# EAGLE design 2023-03-01_Twin_Io_Schematic (EAGLE 9.6.2)
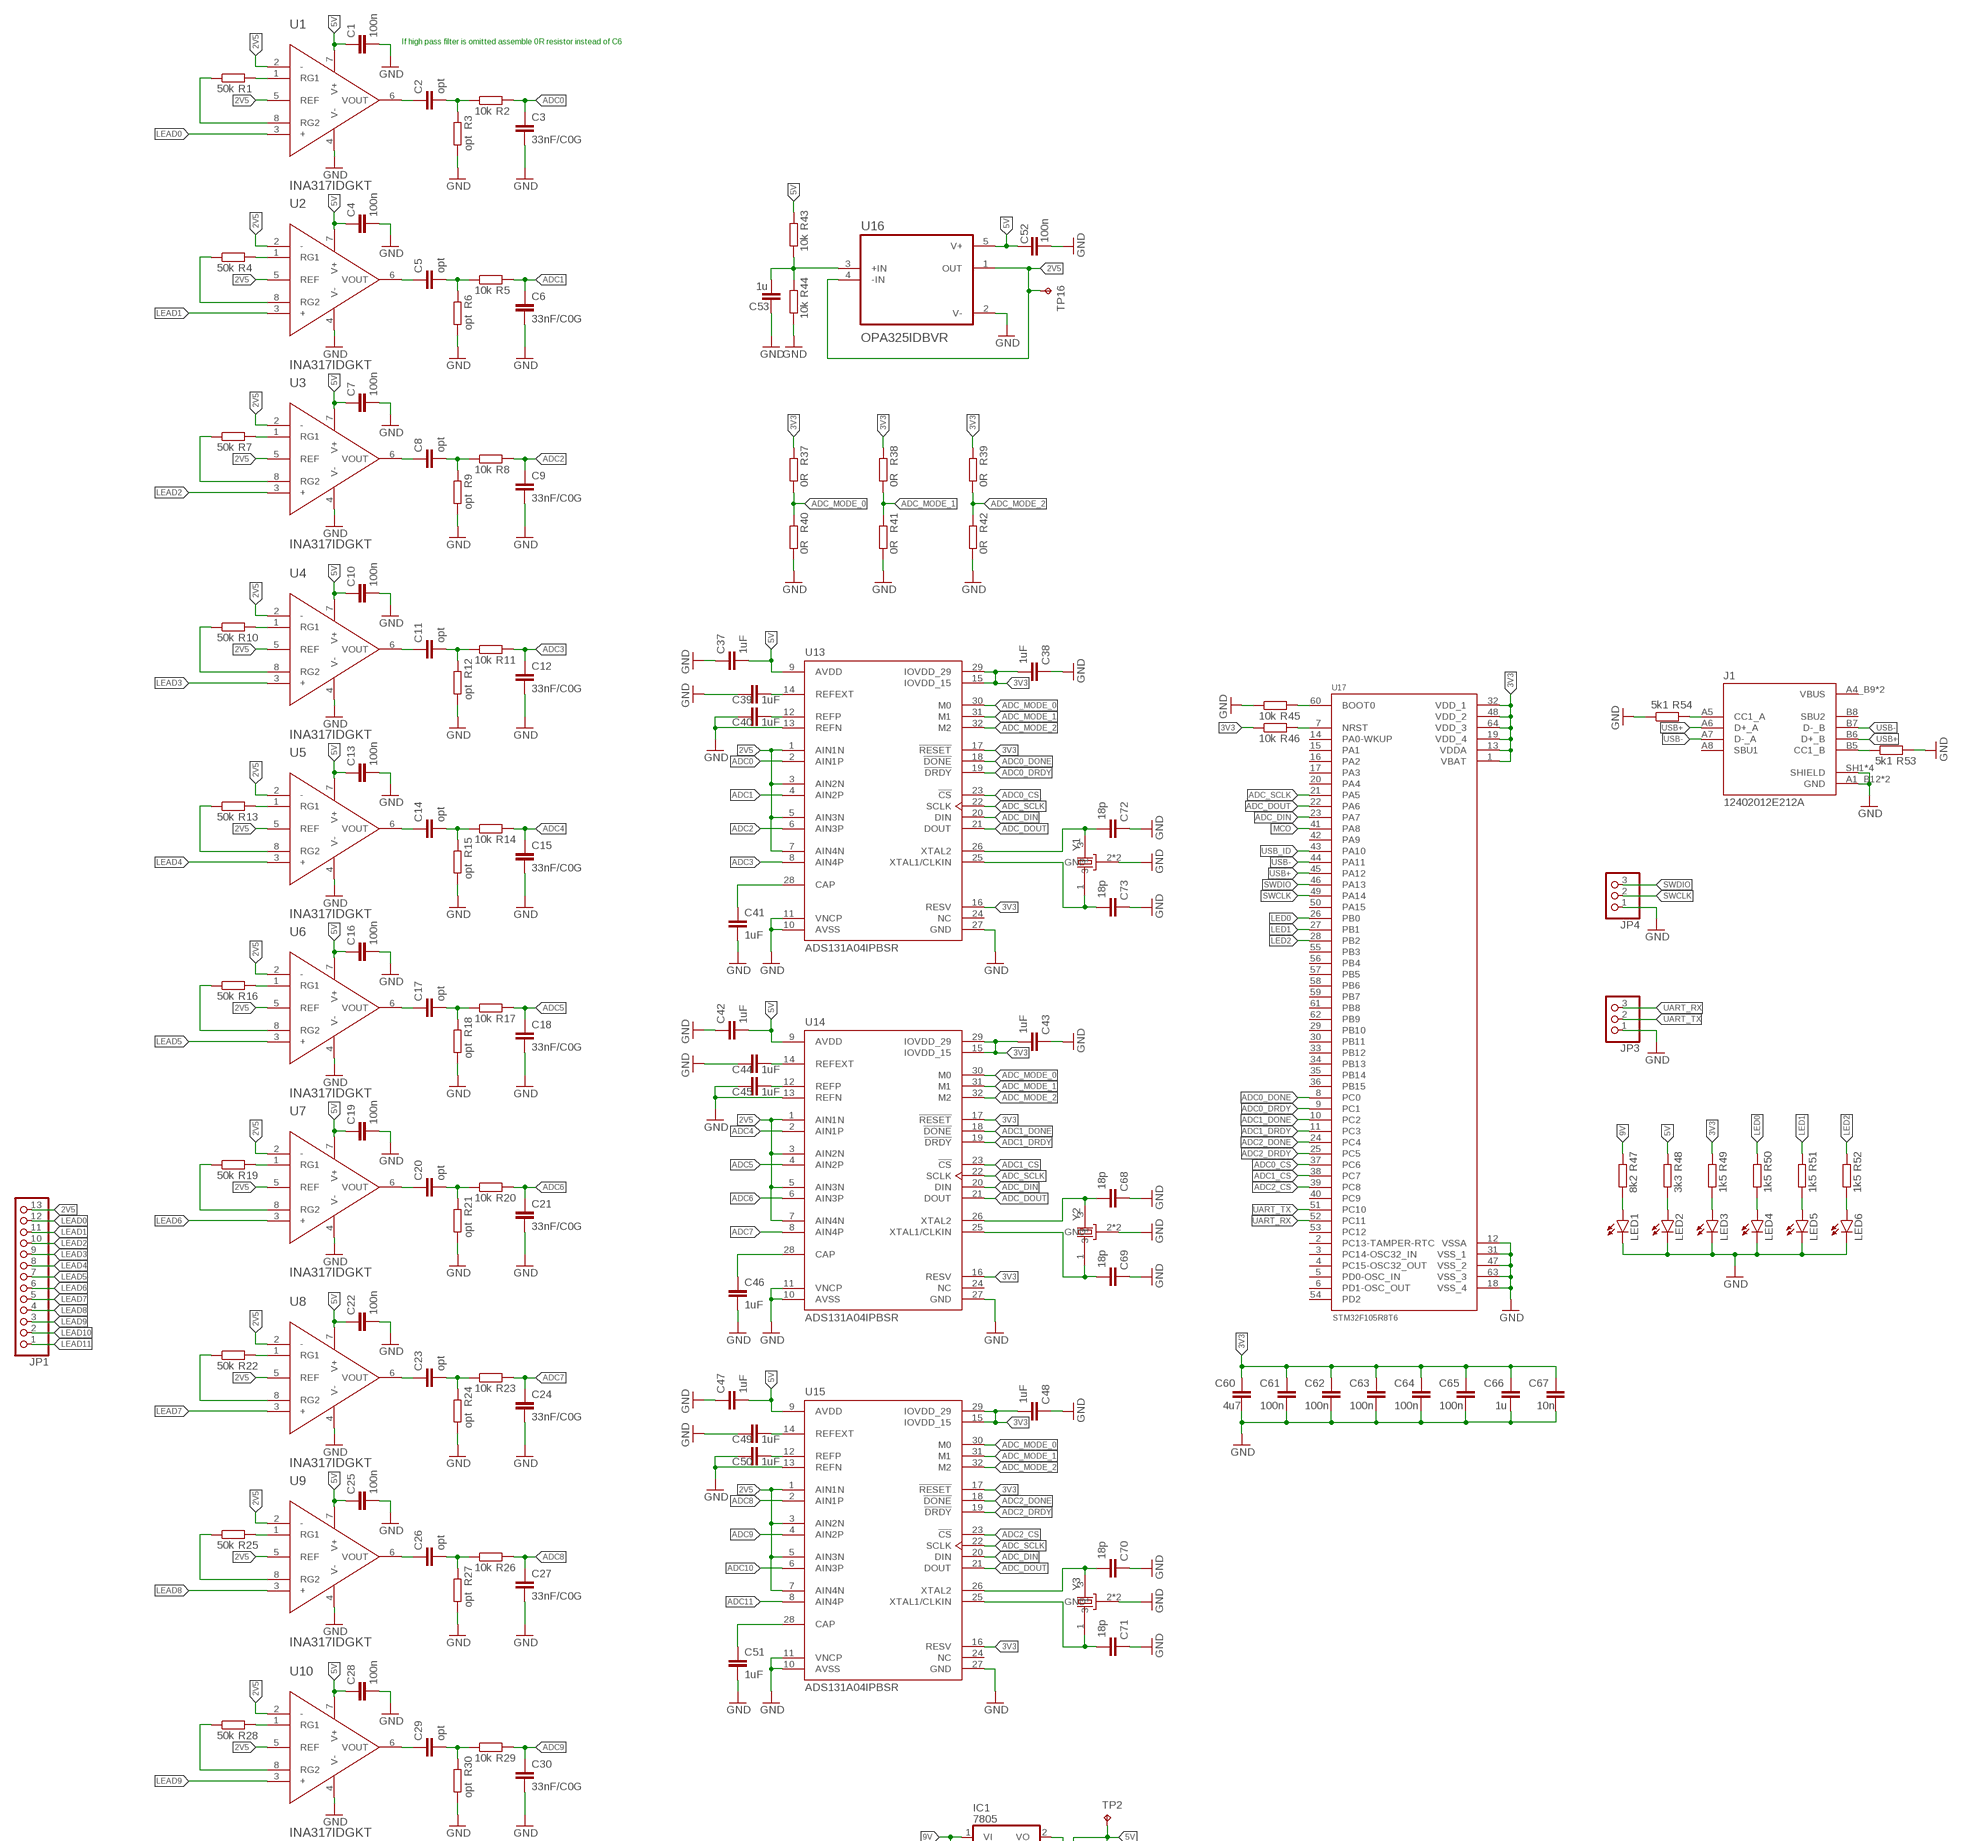
[diagram p0: schematic, sheet 1, part 1 of 2]
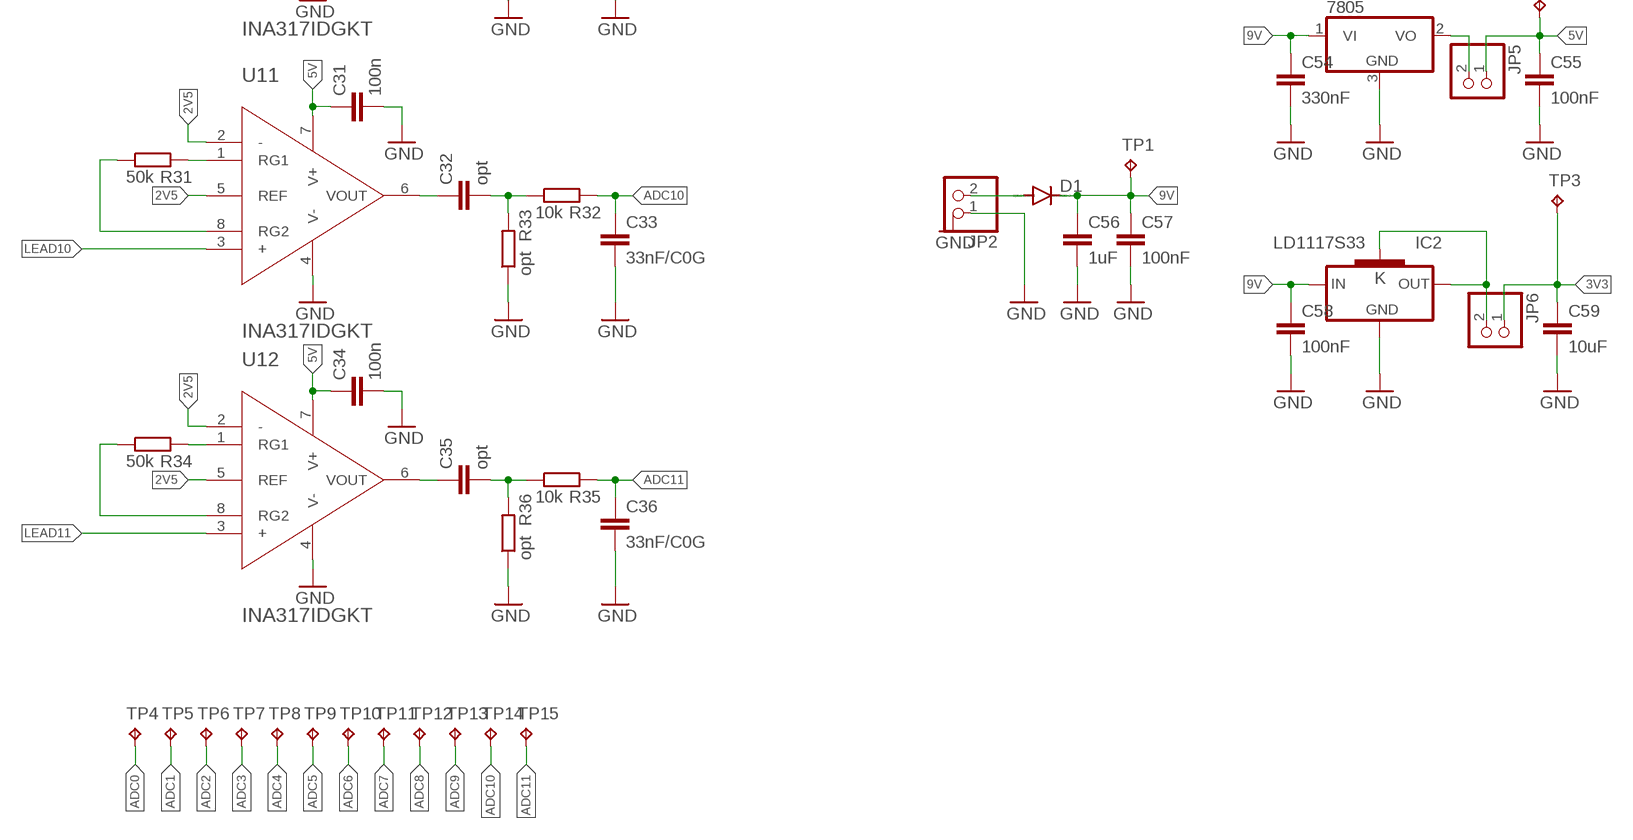
[diagram p1: schematic, sheet 1, part 2 of 2]

## Parts
C1  100n  C-EUC0603  [C0603]
C2  opt  C-EUC0603  [C0603]
C3  33nF/C0G  C-EUC0603  [C0603]
C4  100n  C-EUC0603  [C0603]
C5  opt  C-EUC0603  [C0603]
C6  33nF/C0G  C-EUC0603  [C0603]
C7  100n  C-EUC0603  [C0603]
C8  opt  C-EUC0603  [C0603]
C9  33nF/C0G  C-EUC0603  [C0603]
C10  100n  C-EUC0603  [C0603]
C11  opt  C-EUC0603  [C0603]
C12  33nF/C0G  C-EUC0603  [C0603]
C13  100n  C-EUC0603  [C0603]
C14  opt  C-EUC0603  [C0603]
C15  33nF/C0G  C-EUC0603  [C0603]
C16  100n  C-EUC0603  [C0603]
C17  opt  C-EUC0603  [C0603]
C18  33nF/C0G  C-EUC0603  [C0603]
C19  100n  C-EUC0603  [C0603]
C20  opt  C-EUC0603  [C0603]
C21  33nF/C0G  C-EUC0603  [C0603]
C22  100n  C-EUC0603  [C0603]
C23  opt  C-EUC0603  [C0603]
C24  33nF/C0G  C-EUC0603  [C0603]
C25  100n  C-EUC0603  [C0603]
C26  opt  C-EUC0603  [C0603]
C27  33nF/C0G  C-EUC0603  [C0603]
C28  100n  C-EUC0603  [C0603]
C29  opt  C-EUC0603  [C0603]
C30  33nF/C0G  C-EUC0603  [C0603]
C31  100n  C-EUC0603  [C0603]
C32  opt  C-EUC0603  [C0603]
C33  33nF/C0G  C-EUC0603  [C0603]
C34  100n  C-EUC0603  [C0603]
C35  opt  C-EUC0603  [C0603]
C36  33nF/C0G  C-EUC0603  [C0603]
C37  1uF  C-EUC0603  [C0603]
C38  1uF  C-EUC0603  [C0603]
C39  1uF  C-EUC0603  [C0603]
C40  1uF  C-EUC0603  [C0603]
C41  1uF  C-EUC0603  [C0603]
C42  1uF  C-EUC0603  [C0603]
C43  1uF  C-EUC0603  [C0603]
C44  1uF  C-EUC0603  [C0603]
C45  1uF  C-EUC0603  [C0603]
C46  1uF  C-EUC0603  [C0603]
C47  1uF  C-EUC0603  [C0603]
C48  1uF  C-EUC0603  [C0603]
C49  1uF  C-EUC0603  [C0603]
C50  1uF  C-EUC0603  [C0603]
C51  1uF  C-EUC0603  [C0603]
C52  100n  C-EUC0603  [C0603]
C53  1u  C-EUC0603  [C0603]
C54  330nF  C-EUC0603  [C0603]
C55  100nF  C-EUC0603  [C0603]
C56  1uF  C-EUC0603  [C0603]
C57  100nF  C-EUC0603  [C0603]
C58  100nF  C-EUC0603  [C0603]
C59  10uF  C-EUC0603  [C0603]
C60  4u7  C-EUC0603  [C0603]
C61  100n  C-EUC0603  [C0603]
C62  100n  C-EUC0603  [C0603]
C63  100n  C-EUC0603  [C0603]
C64  100n  C-EUC0603  [C0603]
C65  100n  C-EUC0603  [C0603]
C66  1u  C-EUC0603  [C0603]
C67  10n  C-EUC0603  [C0603]
C68  18p  C-EUC0603  [C0603]
C69  18p  C-EUC0603  [C0603]
C70  18p  C-EUC0603  [C0603]
C71  18p  C-EUC0603  [C0603]
C72  18p  C-EUC0603  [C0603]
C73  18p  C-EUC0603  [C0603]
D1  DIODE-DO214AA  [DO214AA]
IC1  7805  7806DT  [TO252]
IC2  LD1117S33  [SOT223]
J1  12402012E212A  [AMPHENOL_12402012E212A]
JP1  PINHD-1X13  [1X13]
JP2  PINHD-1X2  [1X02]
JP3  PINHD-1X3  [1X03]
JP4  PINHD-1X3  [1X03]
JP5  PINHD-1X2  [1X02]
JP6  PINHD-1X2  [1X02]
LED1  LEDSML1206  [SML1206]
LED2  LEDSML1206  [SML1206]
LED3  LEDSML1206  [SML1206]
LED4  LEDSML1206  [SML1206]
LED5  LEDSML1206  [SML1206]
LED6  LEDSML1206  [SML1206]
R1  50k  R-EU_R0603  [R0603]
R2  10k  R-EU_R0603  [R0603]
R3  opt  R-EU_R0603  [R0603]
R4  50k  R-EU_R0603  [R0603]
R5  10k  R-EU_R0603  [R0603]
R6  opt  R-EU_R0603  [R0603]
R7  50k  R-EU_R0603  [R0603]
R8  10k  R-EU_R0603  [R0603]
R9  opt  R-EU_R0603  [R0603]
R10  50k  R-EU_R0603  [R0603]
R11  10k  R-EU_R0603  [R0603]
R12  opt  R-EU_R0603  [R0603]
R13  50k  R-EU_R0603  [R0603]
R14  10k  R-EU_R0603  [R0603]
R15  opt  R-EU_R0603  [R0603]
R16  50k  R-EU_R0603  [R0603]
R17  10k  R-EU_R0603  [R0603]
R18  opt  R-EU_R0603  [R0603]
R19  50k  R-EU_R0603  [R0603]
R20  10k  R-EU_R0603  [R0603]
R21  opt  R-EU_R0603  [R0603]
R22  50k  R-EU_R0603  [R0603]
R23  10k  R-EU_R0603  [R0603]
R24  opt  R-EU_R0603  [R0603]
R25  50k  R-EU_R0603  [R0603]
R26  10k  R-EU_R0603  [R0603]
R27  opt  R-EU_R0603  [R0603]
R28  50k  R-EU_R0603  [R0603]
R29  10k  R-EU_R0603  [R0603]
R30  opt  R-EU_R0603  [R0603]
R31  50k  R-EU_R0603  [R0603]
R32  10k  R-EU_R0603  [R0603]
R33  opt  R-EU_R0603  [R0603]
R34  50k  R-EU_R0603  [R0603]
R35  10k  R-EU_R0603  [R0603]
R36  opt  R-EU_R0603  [R0603]
R37  0R  R-EU_R0603  [R0603]
R38  0R  R-EU_R0603  [R0603]
R39  0R  R-EU_R0603  [R0603]
R40  0R  R-EU_R0603  [R0603]
R41  0R  R-EU_R0603  [R0603]
R42  0R  R-EU_R0603  [R0603]
R43  10k  R-EU_R0603  [R0603]
R44  10k  R-EU_R0603  [R0603]
R45  10k  R-EU_R0603  [R0603]
R46  10k  R-EU_R0603  [R0603]
R47  8k2  R-EU_R0603  [R0603]
R48  3k3  R-EU_R0603  [R0603]
R49  1k5  R-EU_R0603  [R0603]
R50  1k5  R-EU_R0603  [R0603]
R51  1k5  R-EU_R0603  [R0603]
R52  1k5  R-EU_R0603  [R0603]
R53  5k1  R-EU_R0603  [R0603]
R54  5k1  R-EU_R0603  [R0603]
TP1  TPPAD1-17  [P1-17]
TP2  TPPAD1-17  [P1-17]
TP3  TPPAD1-17  [P1-17]
TP4  TPPAD1-17  [P1-17]
TP5  TPPAD1-17  [P1-17]
TP6  TPPAD1-17  [P1-17]
TP7  TPPAD1-17  [P1-17]
TP8  TPPAD1-17  [P1-17]
TP9  TPPAD1-17  [P1-17]
TP10  TPPAD1-17  [P1-17]
TP11  TPPAD1-17  [P1-17]
TP12  TPPAD1-17  [P1-17]
TP13  TPPAD1-17  [P1-17]
TP14  TPPAD1-17  [P1-17]
TP15  TPPAD1-17  [P1-17]
TP16  TPPAD1-17  [P1-17]
U1  INA317IDGKT  [SOP65P490X110-8N]
U2  INA317IDGKT  [SOP65P490X110-8N]
U3  INA317IDGKT  [SOP65P490X110-8N]
U4  INA317IDGKT  [SOP65P490X110-8N]
U5  INA317IDGKT  [SOP65P490X110-8N]
U6  INA317IDGKT  [SOP65P490X110-8N]
U7  INA317IDGKT  [SOP65P490X110-8N]
U8  INA317IDGKT  [SOP65P490X110-8N]
U9  INA317IDGKT  [SOP65P490X110-8N]
U10  INA317IDGKT  [SOP65P490X110-8N]
U11  INA317IDGKT  [SOP65P490X110-8N]
U12  INA317IDGKT  [SOP65P490X110-8N]
U13  ADS131A04IPBSR  [QFP50P700X700X120-32N]
U14  ADS131A04IPBSR  [QFP50P700X700X120-32N]
U15  ADS131A04IPBSR  [QFP50P700X700X120-32N]
U16  OPA325IDBVR  [SOT95P280X145-5N]
U17  STM32F105R8T6  [QFP50P1200X1200X160-64N]
Y1  ABM3C-16.384MHZ-D4Y-T  [OSCCC500X320X110-4N]
Y2  ABM3C-16.384MHZ-D4Y-T  [OSCCC500X320X110-4N]
Y3  ABM3C-16.384MHZ-D4Y-T  [OSCCC500X320X110-4N]

## Nets
2V5: JP1.13 TP16.TP U1.2(-) U1.5(REF) U2.2(-) U2.5(REF) U3.2(-) U3.5(REF) U4.2(-) U4.5(REF) U5.2(-) U5.5(REF) U6.2(-) U6.5(REF) U7.2(-) U7.5(REF) U8.2(-) U8.5(REF) U9.2(-) U9.5(REF) U10.2(-) U10.5(REF) U11.2(-) U11.5(REF) U12.2(-) U12.5(REF) U13.1(AIN1N) U13.3(AIN2N) U13.5(AIN3N) U13.7(AIN4N) U14.1(AIN1N) U14.3(AIN2N) U14.5(AIN3N) U14.7(AIN4N) U15.1(AIN1N) U15.3(AIN2N) U15.5(AIN3N) U15.7(AIN4N) U16.1(OUT) U16.4(-IN)
3V3: C38.2 C43.2 C48.2 C59.1 C60.1 C61.1 C62.1 C63.1 C64.1 C65.1 C66.1 C67.1 JP6.1 R37.2 R38.2 R39.2 R46.1 R49.2 TP3.TP U13.15(IOVDD_15) U13.16(RESV) U13.17(!RESET) U13.29(IOVDD_29) U14.15(IOVDD_15) U14.16(RESV) U14.17(!RESET) U14.29(IOVDD_29) U15.15(IOVDD_15) U15.16(RESV) U15.17(!RESET) U15.29(IOVDD_29) U17.1(VBAT) U17.13(VDDA) U17.19(VDD_4) U17.32(VDD_1) U17.48(VDD_2) U17.64(VDD_3)
5V: C1.1 C4.1 C7.1 C10.1 C13.1 C16.1 C19.1 C22.1 C25.1 C28.1 C31.1 C34.1 C37.2 C42.2 C47.2 C52.1 C55.1 JP5.1 R43.2 R48.2 TP2.TP U1.7(V+) U2.7(V+) U3.7(V+) U4.7(V+) U5.7(V+) U6.7(V+) U7.7(V+) U8.7(V+) U9.7(V+) U10.7(V+) U11.7(V+) U12.7(V+) U13.9(AVDD) U14.9(AVDD) U15.9(AVDD) U16.5(V+)
9V: C54.1 C56.1 C57.1 C58.1 D1.C IC1.1(VI) IC2.3(IN) R47.2 TP1.TP
ADC0: C3.1 R2.2 TP4.TP U13.2(AIN1P)
ADC0_CS: U13.23(!CS) U17.37(PC6)
ADC0_DONE: U13.18(!DONE) U17.8(PC0)
ADC0_DRDY: U13.19(!DRDY) U17.9(PC1)
ADC1: C6.1 R5.2 TP5.TP U13.4(AIN2P)
ADC1_CS: U14.23(!CS) U17.38(PC7)
ADC1_DONE: U14.18(!DONE) U17.10(PC2)
ADC1_DRDY: U14.19(!DRDY) U17.11(PC3)
ADC2: C9.1 R8.2 TP6.TP U13.6(AIN3P)
ADC2_CS: U15.23(!CS) U17.39(PC8)
ADC2_DONE: U15.18(!DONE) U17.24(PC4)
ADC2_DRDY: U15.19(!DRDY) U17.25(PC5)
ADC3: C12.1 R11.2 TP7.TP U13.8(AIN4P)
ADC4: C15.1 R14.2 TP8.TP U14.2(AIN1P)
ADC5: C18.1 R17.2 TP9.TP U14.4(AIN2P)
ADC6: C21.1 R20.2 TP10.TP U14.6(AIN3P)
ADC7: C24.1 R23.2 TP11.TP U14.8(AIN4P)
ADC8: C27.1 R26.2 TP12.TP U15.2(AIN1P)
ADC9: C30.1 R29.2 TP13.TP U15.4(AIN2P)
ADC10: C33.1 R32.2 TP14.TP U15.6(AIN3P)
ADC11: C36.1 R35.2 TP15.TP U15.8(AIN4P)
ADC_DIN: U13.20(DIN) U14.20(DIN) U15.20(DIN) U17.23(PA7)
ADC_DOUT: U13.21(DOUT) U14.21(DOUT) U15.21(DOUT) U17.22(PA6)
ADC_MODE_0: R37.1 R40.2 U13.30(M0) U14.30(M0) U15.30(M0)
ADC_MODE_1: R38.1 R41.2 U13.31(M1) U14.31(M1) U15.31(M1)
ADC_MODE_2: R39.1 R42.2 U13.32(M2) U14.32(M2) U15.32(M2)
ADC_SCLK: U13.22(SCLK) U14.22(SCLK) U15.22(SCLK) U17.21(PA5)
GND: C1.2 C3.2 C4.2 C6.2 C7.2 C9.2 C10.2 C12.2 C13.2 C15.2 C16.2 C18.2 C19.2 C21.2 C22.2 C24.2 C25.2 C27.2 C28.2 C30.2 C31.2 C33.2 C34.2 C36.2 C37.1 C38.1 C39.1 C40.1 C41.2 C42.1 C43.1 C44.1 C45.1 C46.2 C47.1 C48.1 C49.1 C50.1 C51.2 C52.2 C53.1 C54.2 C55.2 C56.2 C57.2 C58.2 C59.2 C60.2 C61.2 C62.2 C63.2 C64.2 C65.2 C66.2 C67.2 C68.1 C69.1 C70.1 C71.1 C72.1 C73.1 IC1.3(GND) IC2.1(GND) J1.A1_B12(GND) J1.B1_A12(GND) J1.SH1(SHIELD) J1.SH2(SHIELD) J1.SH3(SHIELD) J1.SH4(SHIELD) JP2.1 JP3.1 JP4.1 LED1.C LED2.C LED3.C LED4.C LED5.C LED6.C R3.1 R6.1 R9.1 R12.1 R15.1 R18.1 R21.1 R24.1 R27.1 R30.1 R33.1 R36.1 R40.1 R41.1 R42.1 R44.1 R45.1 R53.2 R54.1 U1.4(V-) U2.4(V-) U3.4(V-) U4.4(V-) U5.4(V-) U6.4(V-) U7.4(V-) U8.4(V-) U9.4(V-) U10.4(V-) U11.4(V-) U12.4(V-) U13.10(AVSS) U13.11(VNCP) U13.13(REFN) U13.27(GND) U14.10(AVSS) U14.11(VNCP) U14.13(REFN) U14.27(GND) U15.10(AVSS) U15.11(VNCP) U15.13(REFN) U15.27(GND) U16.2(V-) U17.12(VSSA) U17.18(VSS_4) U17.31(VSS_1) U17.47(VSS_2) U17.63(VSS_3) Y1.2(GND) Y1.4(GND) Y2.2(GND) Y2.4(GND) Y3.2(GND) Y3.4(GND)
LEAD0: JP1.12 U1.3(+)
LEAD1: JP1.11 U2.3(+)
LEAD2: JP1.10 U3.3(+)
LEAD3: JP1.9 U4.3(+)
LEAD4: JP1.8 U5.3(+)
LEAD5: JP1.7 U6.3(+)
LEAD6: JP1.6 U7.3(+)
LEAD7: JP1.5 U8.3(+)
LEAD8: JP1.4 U9.3(+)
LEAD9: JP1.3 U10.3(+)
LEAD10: JP1.2 U11.3(+)
LEAD11: JP1.1 U12.3(+)
LED0: R50.2 U17.26(PB0)
LED1: R51.2 U17.27(PB1)
LED2: R52.2 U17.28(PB2)
MCO: U17.41(PA8)
N$1: R1.2 U1.1(RG1)
N$2: R1.1 U1.8(RG2)
N$3: C2.1 U1.6(VOUT)
N$4: C2.2 R2.1 R3.2
N$5: D1.A JP2.2
N$6: C41.1 U13.28(CAP)
N$7: C72.2 U13.26(XTAL2) Y1.3
N$8: C73.2 U13.25(XTAL1/CLKIN) Y1.1
N$9: C40.2 U13.12(REFP)
N$10: C39.2 U13.14(REFEXT)
N$11: R4.2 U2.1(RG1)
N$12: R4.1 U2.8(RG2)
N$13: C5.1 U2.6(VOUT)
N$14: C5.2 R5.1 R6.2
N$15: R7.2 U3.1(RG1)
N$16: R7.1 U3.8(RG2)
N$17: C8.1 U3.6(VOUT)
N$18: C8.2 R8.1 R9.2
N$19: R10.2 U4.1(RG1)
N$20: R10.1 U4.8(RG2)
N$21: C11.1 U4.6(VOUT)
N$22: C11.2 R11.1 R12.2
N$23: R13.2 U5.1(RG1)
N$24: R13.1 U5.8(RG2)
N$25: C14.1 U5.6(VOUT)
N$26: C14.2 R14.1 R15.2
N$27: R16.2 U6.1(RG1)
N$28: R16.1 U6.8(RG2)
N$29: C17.1 U6.6(VOUT)
N$30: C17.2 R17.1 R18.2
N$31: R19.2 U7.1(RG1)
N$32: R19.1 U7.8(RG2)
N$33: C20.1 U7.6(VOUT)
N$34: C20.2 R20.1 R21.2
N$35: R22.2 U8.1(RG1)
N$36: R22.1 U8.8(RG2)
N$37: C23.1 U8.6(VOUT)
N$38: C23.2 R23.1 R24.2
N$39: R25.2 U9.1(RG1)
N$40: R25.1 U9.8(RG2)
N$41: C26.1 U9.6(VOUT)
N$42: C26.2 R26.1 R27.2
N$43: C69.2 U14.25(XTAL1/CLKIN) Y2.1
N$44: C46.1 U14.28(CAP)
N$45: C44.2 U14.14(REFEXT)
N$46: C68.2 U14.26(XTAL2) Y2.3
N$47: C45.2 U14.12(REFP)
N$48: C70.2 U15.26(XTAL2) Y3.3
N$49: C51.1 U15.28(CAP)
N$50: C49.2 U15.14(REFEXT)
N$51: C71.2 U15.25(XTAL1/CLKIN) Y3.1
N$52: C50.2 U15.12(REFP)
N$53: R28.2 U10.1(RG1)
N$54: R28.1 U10.8(RG2)
N$55: C29.1 U10.6(VOUT)
N$56: C29.2 R29.1 R30.2
N$57: R31.2 U11.1(RG1)
N$58: R31.1 U11.8(RG2)
N$59: C32.1 U11.6(VOUT)
N$60: C32.2 R32.1 R33.2
N$61: R34.2 U12.1(RG1)
N$62: R34.1 U12.8(RG2)
N$63: C35.1 U12.6(VOUT)
N$64: C35.2 R35.1 R36.2
N$65: R45.2 U17.60(BOOT0)
N$66: R46.2 U17.7(NRST)
N$67: C53.2 R43.1 R44.2 U16.3(+IN)
N$68: LED1.A R47.1
N$69: LED2.A R48.1
N$70: LED3.A R49.1
N$71: LED4.A R50.1
N$72: LED5.A R51.1
N$73: LED6.A R52.1
N$74: J1.A5(CC1_A) R54.2
N$75: J1.B5(CC1_B) R53.1
N$76: IC1.2(VO) JP5.2
N$78: IC2.2(OUT) IC2.4(K) JP6.2
SWCLK: JP4.2 U17.49(PA14)
SWDIO: JP4.3 U17.46(PA13)
UART_RX: JP3.3 U17.52(PC11)
UART_TX: JP3.2 U17.51(PC10)
USB+: J1.A6(D+_A) J1.B6(D+_B) U17.45(PA12)
USB-: J1.A7(D-_A) J1.B7(D-_B) U17.44(PA11)
USB_ID: U17.43(PA10)
Unconnected: J1.A8(SBU1) J1.B8(SBU2) U13.24(NC) U14.24(NC) U15.24(NC) U17.2(PC13-TAMPER-RTC) U17.3(PC14-OSC32_IN) U17.4(PC15-OSC32_OUT) U17.5(PD0-OSC_IN) U17.6(PD1-OSC_OUT) U17.14(PA0-WKUP) U17.15(PA1) U17.16(PA2) U17.17(PA3) U17.20(PA4) U17.29(PB10) U17.30(PB11) U17.33(PB12) U17.34(PB13) U17.35(PB14) U17.36(PB15) U17.40(PC9) U17.42(PA9) U17.50(PA15) U17.53(PC12) U17.54(PD2) U17.55(PB3) U17.56(PB4) U17.57(PB5) U17.58(PB6) U17.59(PB7) U17.61(PB8) U17.62(PB9)

## Notes on the sheet
- If high pass filter is omitted assemble 0R resistor instead of C6

## Power pins joined to a net without a drawn wire
VBUS: J1.A4_B9(VBUS) J1.B4_A9(VBUS)

## Library data of the parts
C1-C73 = rcl:C-EU: CAPACITOR, European symbol; SPICEPREFIX: C
D1 = diode:DIODE-: DIODE
IC1 = linear:78*: Positive VOLTAGE REGULATOR Source: http://cache.national.com/ds/LM/LM78L05.pdf http://www.fairchildsemi.com/ds/LM/LM7805.pdf
IC2 = LD1117S33:LD1117S33: VOLTAGE REGULATOR SMD 3,3V Check availability <https://pricing.snapeda.com/parts/LD1117S33/STMicroelectronics/view-part?ref=eda>; AVAILABILITY: In Stock; CHECK_PRICES: https://www.snapeda.com/parts/LD1117S33/STMicroelectronics/view-part/?ref=eda; DESCRIPTION: Linear Voltage Regulator IC Positive Fixed 1 Output 800mA SOT-223; MF: STMicroelectronics; MP: LD1117S33; PACKAGE: TO-261-4 STMicroelectronics; PRICE: None; PURCHASE-URL: https://www.snapeda.com/api/url_track_click_mouser/?unipart_id=558863&manufacturer=STMicroelectronics&part_name=LD1117S33&search_term=ld1117; SNAPEDA_LINK: https://www.snapeda.com/parts/LD1117S33/STMicroelectronics/view-part/?ref=snap
J1 = USB-C:12402012E212A: Check availability <https://pricing.snapeda.com/parts/12402012E212A/Amphenol/view-part?ref=eda>; AVAILABILITY: In Stock; CHECK_PRICES: https://www.snapeda.com/parts/12402012E212A/Amphenol/view-part/?ref=eda; DESCRIPTION: USB2.0, Type C, Top mount, CH 1.68mm, Dual Row SMT; MF: Amphenol; MP: 12402012E212A; PACKAGE: None; PRICE: None; PURCHASE-URL: https://www.snapeda.com/api/url_track_click_mouser/?unipart_id=12292287&manufacturer=Amphenol&part_name=12402012E212A&search_term= 12402012e212a; SNAPEDA_LINK: https://www.snapeda.com/parts/12402012E212A/Amphenol/view-part/?ref=snap
JP1 = pinhead:PINHD-1X13: PIN HEADER
JP2 JP5 JP6 = pinhead:PINHD-1X2: PIN HEADER
JP3 JP4 = pinhead:PINHD-1X3: PIN HEADER
LED1-LED6 = led:LED: LED OSRAM: - CHIPLED LG R971, LG N971, LY N971, LG Q971, LY Q971, LO R971, LY R971 LH N974, LH R974 LS Q976, LO Q976, LY Q976 LO Q996 - Hyper CHIPLED LW Q18S LB Q993, LB Q99A, LB R99A - SideLED LS A670, LO A670, LY A670, LG A670, LP A670 LB A673, LV A673, LT A673, LW A673 LH A674 LY A675 LS A676, LA A676, LO A676, LY A676, LW A676 LS A679, LY A679, LG A679 - Hyper Micro SIDELED® LS Y876, LA Y876, LO Y876, LY Y876 LT Y87S - SmartLED LW L88C, LW L88S LB L89C, LB L89S, LG L890 LS L89K, LO L89K, LY L89K LS L896, LA L896, LO L896, LY L896 - TOPLED LS T670, LO T670, LY T670, LG T670, LP T670 LSG T670, LSP T670, LSY T670, LOP T670, LYG T670 LG T671, LOG T671, LSG T671 LB T673, LV T673, LT T673, LW T673 LH T674 LS T676, LA T676, LO T676, LY T676, LB T676, LH T676, LSB T676, LW T676 LB T67C, LV T67C, LT T67C, LS T67K, LO T67K, LY T67K, LW E67C LS E67B, LA E67B, LO E67B, LY E67B, LB E67C, LV E67C, LT E67C LW T67C LS T679, LY T679, LG T679 LS T770, LO T770, LY T770, LG T770, LP T770 LB T773, LV T773, LT T773, LW T773 LH T774 LS E675, LA E675, LY E675, LS T675 LS T776, LA T776, LO T776, LY T776, LB T776 LHGB T686 LT T68C, LB T68C - Hyper Mini TOPLED® LB M676 - Mini TOPLED Santana® LG M470 LS M47K, LO M47K, LY M47K Source: http://www.osram.convergy.de LUXEON: - LUMILED® LXK2-PW12-R00, LXK2-PW12-S00, LXK2-PW14-U00, LXK2-PW14-V00 LXK2-PM12-R00, LXK2-PM12-S00, LXK2-PM14-U00 LXK2-PE12-Q00, LXK2-PE12-R00, LXK2-PE12-S00, LXK2-PE14-T00, LXK2-PE14-U00 LXK2-PB12-K00, LXK2-PB12-L00, LXK2-PB12-M00, LXK2-PB14-N00, LXK2-PB14-P00, LXK2-PB14-Q00 LXK2-PR12-L00, LXK2-PR12-M00, LXK2-PR14-Q00, LXK2-PR14-R00 LXK2-PD12-Q00, LXK2-PD12-R00, LXK2-PD12-S00 LXK2-PH12-R00, LXK2-PH12-S00 LXK2-PL12-P00, LXK2-PL12-Q00, LXK2-PL12-R00 Source: www.luxeon.com KINGBRIGHT: KA-3528ASYC Source: www.kingbright.com
R1-R54 = rcl:R-EU_: RESISTOR, European symbol; SPICEPREFIX: R
TP1-TP16 = testpad:TP: Test pad
U1-U12 = INA317IDGKT:INA317IDGKT: Check availability <https://pricing.snapeda.com/parts/INA317IDGKT/Texas%20Instruments/view-part?ref=eda>; AVAILABILITY: In Stock; CHECK_PRICES: https://www.snapeda.com/parts/INA317IDGKT/Texas+Instruments/view-part/?ref=eda; DESCRIPTION: Micro-power (50µA), zero-drift (75µV offset, 0.3µV/˚C), precision RRO instrumentation amplifier; MF: Texas Instruments; MP: INA317IDGKT; PACKAGE: VSSOP-8 Texas Instruments; PRICE: None; PURCHASE-URL: https://www.snapeda.com/api/url_track_click_mouser/?unipart_id=3077446&manufacturer=Texas Instruments&part_name=INA317IDGKT&search_term=ina317; SNAPEDA_LINK: https://www.snapeda.com/parts/INA317IDGKT/Texas+Instruments/view-part/?ref=snap
U13-U15 = ADS131A04IPBSR:ADS131A04IPBSR: 24-bit 128-kSPS 4-channel simultaneous-sampling delta-sigma ADC 32-TQFP -40 to 125 Check availability <https://pricing.snapeda.com/parts/ADS131A04IPBSR/Texas%20Instruments/view-part?ref=eda>; AVAILABILITY: In Stock; CHECK_PRICES: https://www.snapeda.com/parts/ADS131A04IPBSR/Texas+Instruments/view-part/?ref=eda; DESCRIPTION: 24-bit 128-kSPS 4-channel simultaneous-sampling delta-sigma ADC; MF: Texas Instruments; MP: ADS131A04IPBSR; PACKAGE: TQFP-32 Texas Instruments; PRICE: None; PURCHASE-URL: https://www.snapeda.com/api/url_track_click_mouser/?unipart_id=547394&manufacturer=Texas Instruments&part_name=ADS131A04IPBSR&search_term=ads131; SNAPEDA_LINK: https://www.snapeda.com/parts/ADS131A04IPBSR/Texas+Instruments/view-part/?ref=snap
U16 = OPA325IDBVR:OPA325IDBVR: Check availability <https://pricing.snapeda.com/parts/OPA325IDBVR/Texas%20Instruments/view-part?ref=eda>; AVAILABILITY: In Stock; CHECK_PRICES: https://www.snapeda.com/parts/OPA325IDBVR/Texas+Instruments/view-part/?ref=eda; DESCRIPTION: Low noise (10nV/rtHz), wide bandwidth (10MHz), low power (0.65mA), zero crossover op amp; MF: Texas Instruments; MP: OPA325IDBVR; PACKAGE: SOT-23-5 Texas Instruments; PRICE: None; PURCHASE-URL: https://www.snapeda.com/api/url_track_click_mouser/?unipart_id=4794140&manufacturer=Texas Instruments&part_name=OPA325IDBVR&search_term=opa325; SNAPEDA_LINK: https://www.snapeda.com/parts/OPA325IDBVR/Texas+Instruments/view-part/?ref=snap
U17 = STM32F105R8T6:STM32F105R8T6: Mainstream Connectivity line, ARM Cortex-M3 with 64 Kbytes Flash, 72 MHz CPU, CAN, USB 2.0 OTG Check availability <https://pricing.snapeda.com/parts/STM32F105R8T6/STMicroelectronics/view-part?ref=eda>; AVAILABILITY: In Stock; CHECK_PRICES: https://www.snapeda.com/parts/STM32F105R8T6/STMicroelectronics/view-part/?ref=eda; DESCRIPTION: ARM® Cortex®-M3 STM32F1 Microcontroller IC 32-Bit 72MHz 64KB (64K x 8) FLASH 64-LQFP (10x10); MF: STMicroelectronics; MP: STM32F105R8T6; PACKAGE: LQFP-64 STMicroelectronics; PRICE: None; PURCHASE-URL: https://www.snapeda.com/api/url_track_click_mouser/?unipart_id=423032&manufacturer=STMicroelectronics&part_name=STM32F105R8T6&search_term=stm32f105r8; SNAPEDA_LINK: https://www.snapeda.com/parts/STM32F105R8T6/STMicroelectronics/view-part/?ref=snap
Y1-Y3 = ABM3C-16.384MHZ-D4Y-T:ABM3C-16.384MHZ-D4Y-T: Ceramic SMD Crystal Check availability <https://pricing.snapeda.com/parts/ABM3C-16.384MHZ-D4Y-T/Abracon/view-part?ref=eda>; AVAILABILITY: In Stock; CHECK_PRICES: https://www.snapeda.com/parts/ABM3C-16.384MHZ-D4Y-T/Abracon+LLC/view-part/?ref=eda; DESCRIPTION: 16.384 MHz ±30ppm Crystal 18pF 50 Ohms 4-SMD, No Lead; MF: Abracon; MP: ABM3C-16.384MHZ-D4Y-T; PACKAGE: SMD-4 Abracon; PRICE: None; PURCHASE-URL: https://www.snapeda.com/api/url_track_click_mouser/?unipart_id=480615&manufacturer=Abracon&part_name=ABM3C-16.384MHZ-D4Y-T&search_term=abm3c-16.384mhz-d4y-t; SNAPEDA_LINK: https://www.snapeda.com/parts/ABM3C-16.384MHZ-D4Y-T/Abracon+LLC/view-part/?ref=snap

## Board
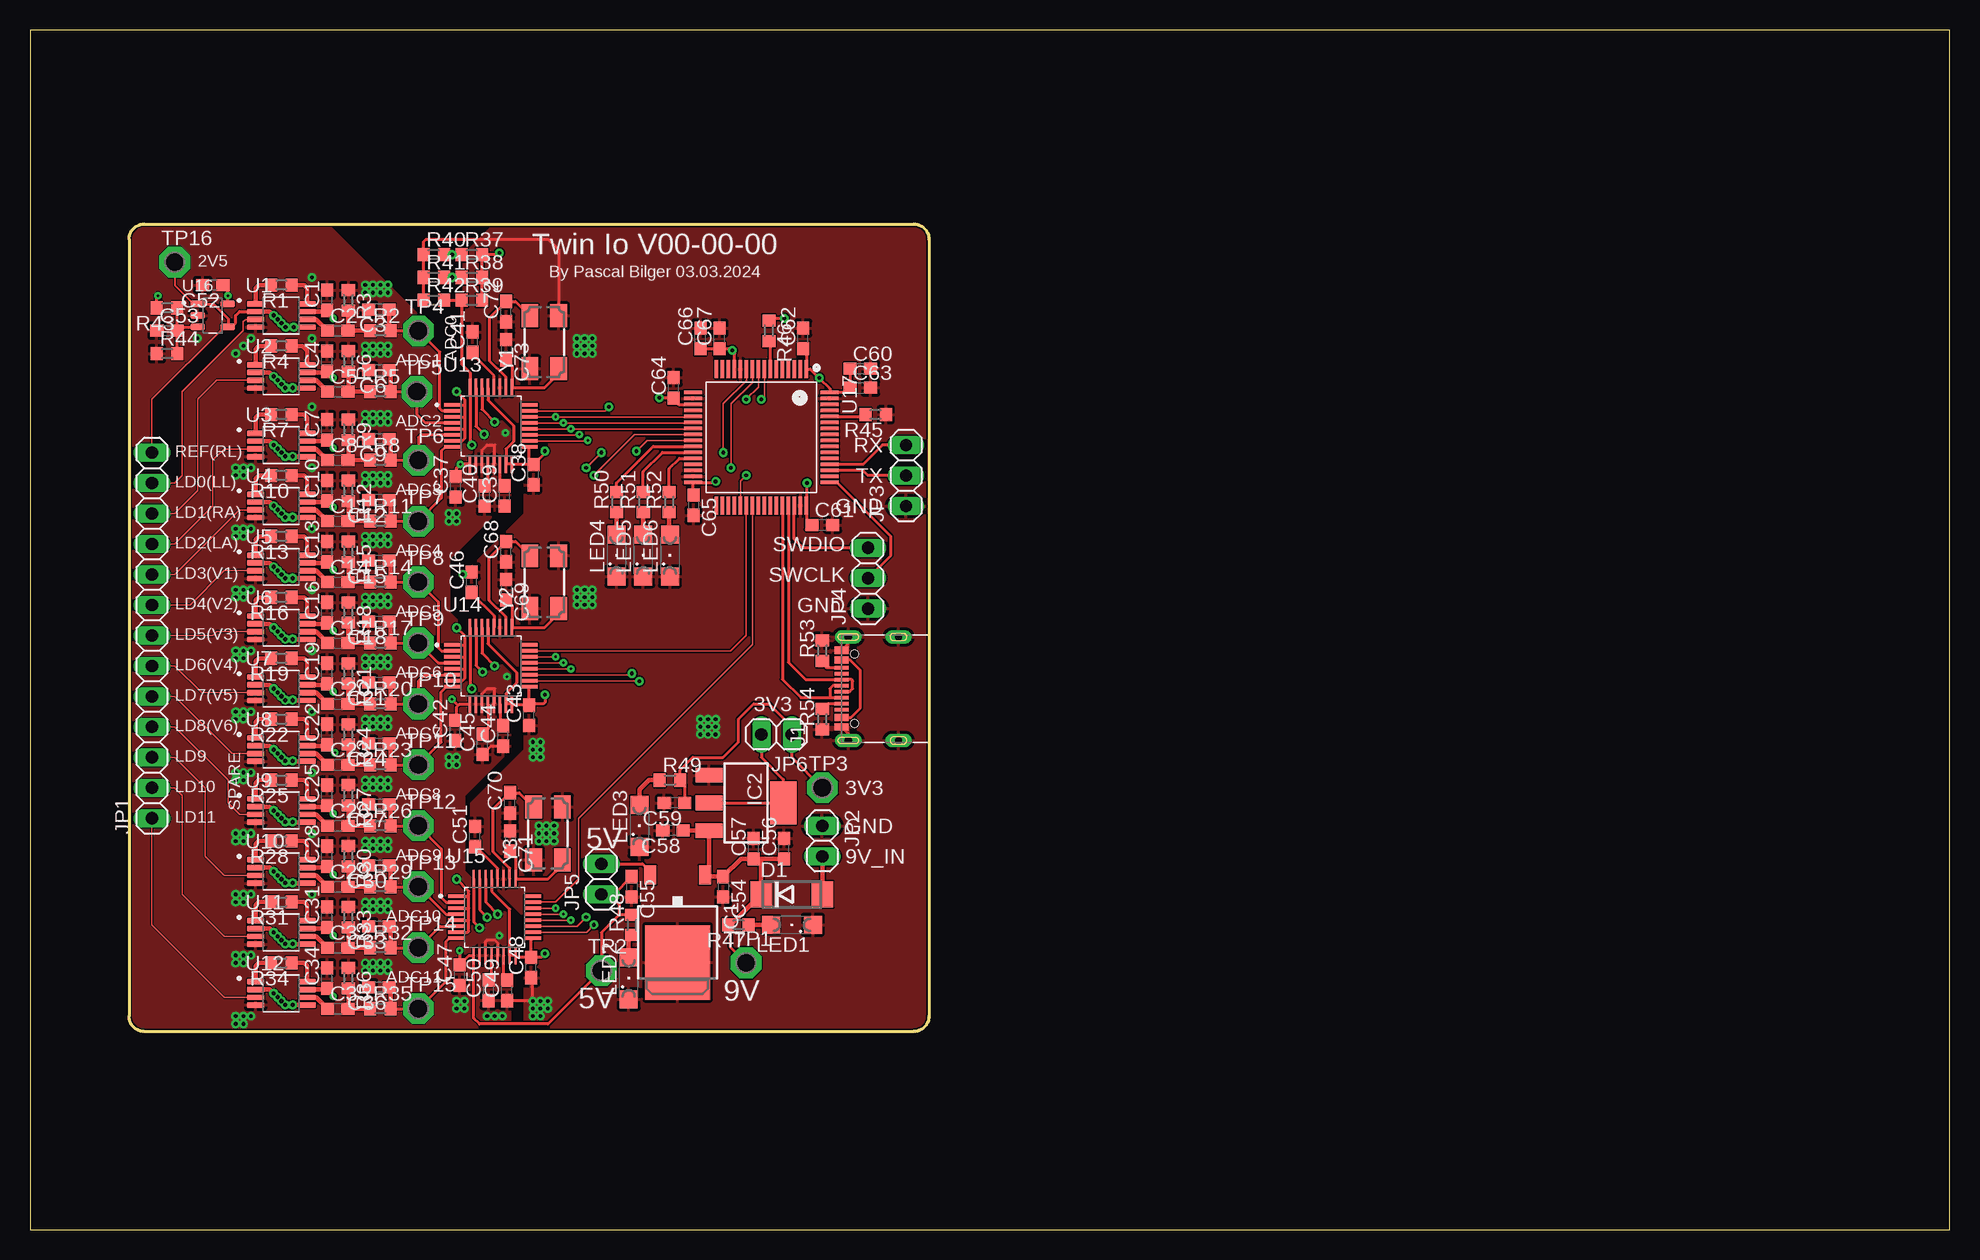
[diagram p2: board, top side]
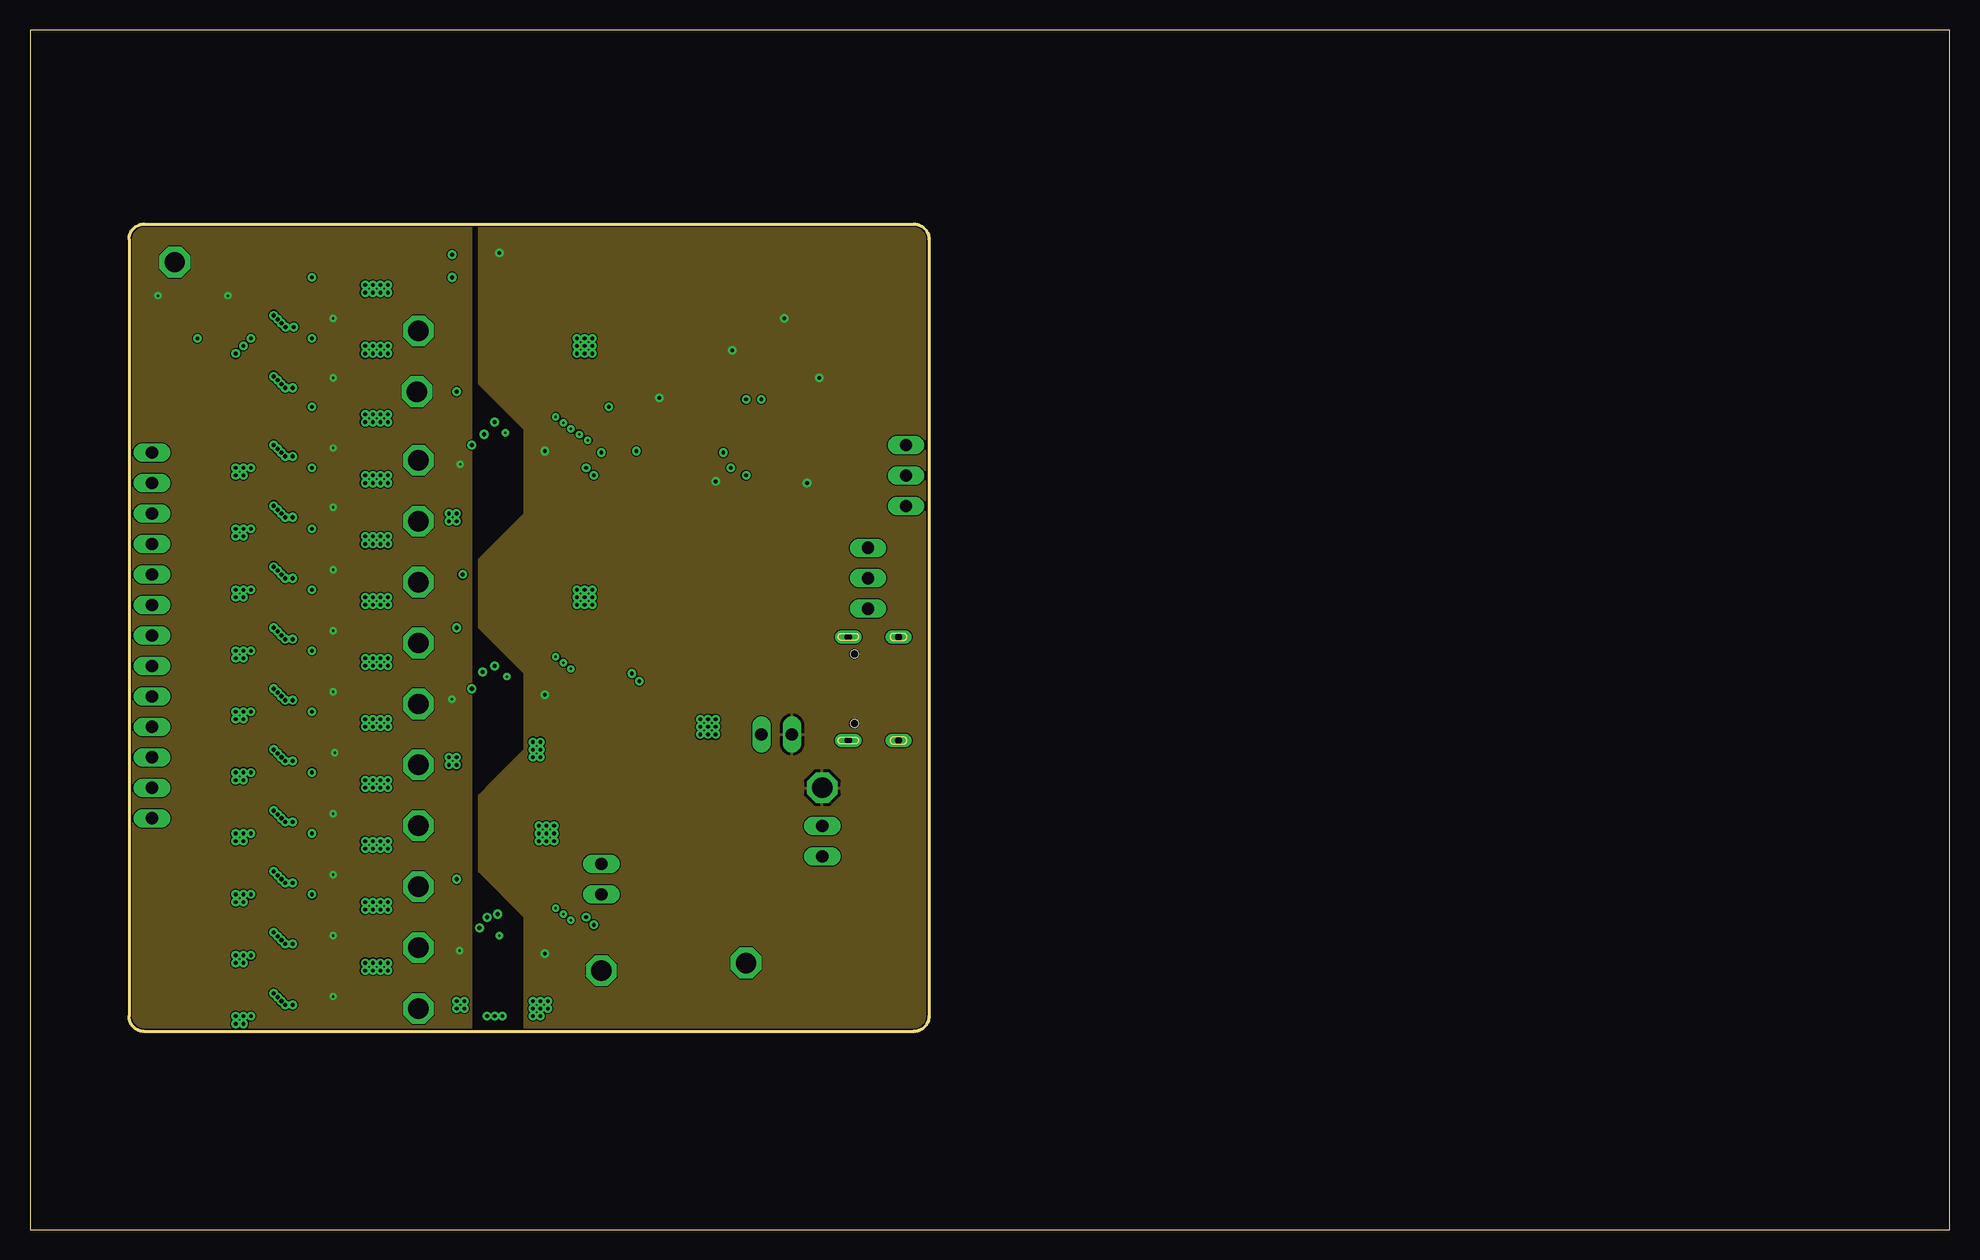
[diagram p3: board, inner layer Route2]
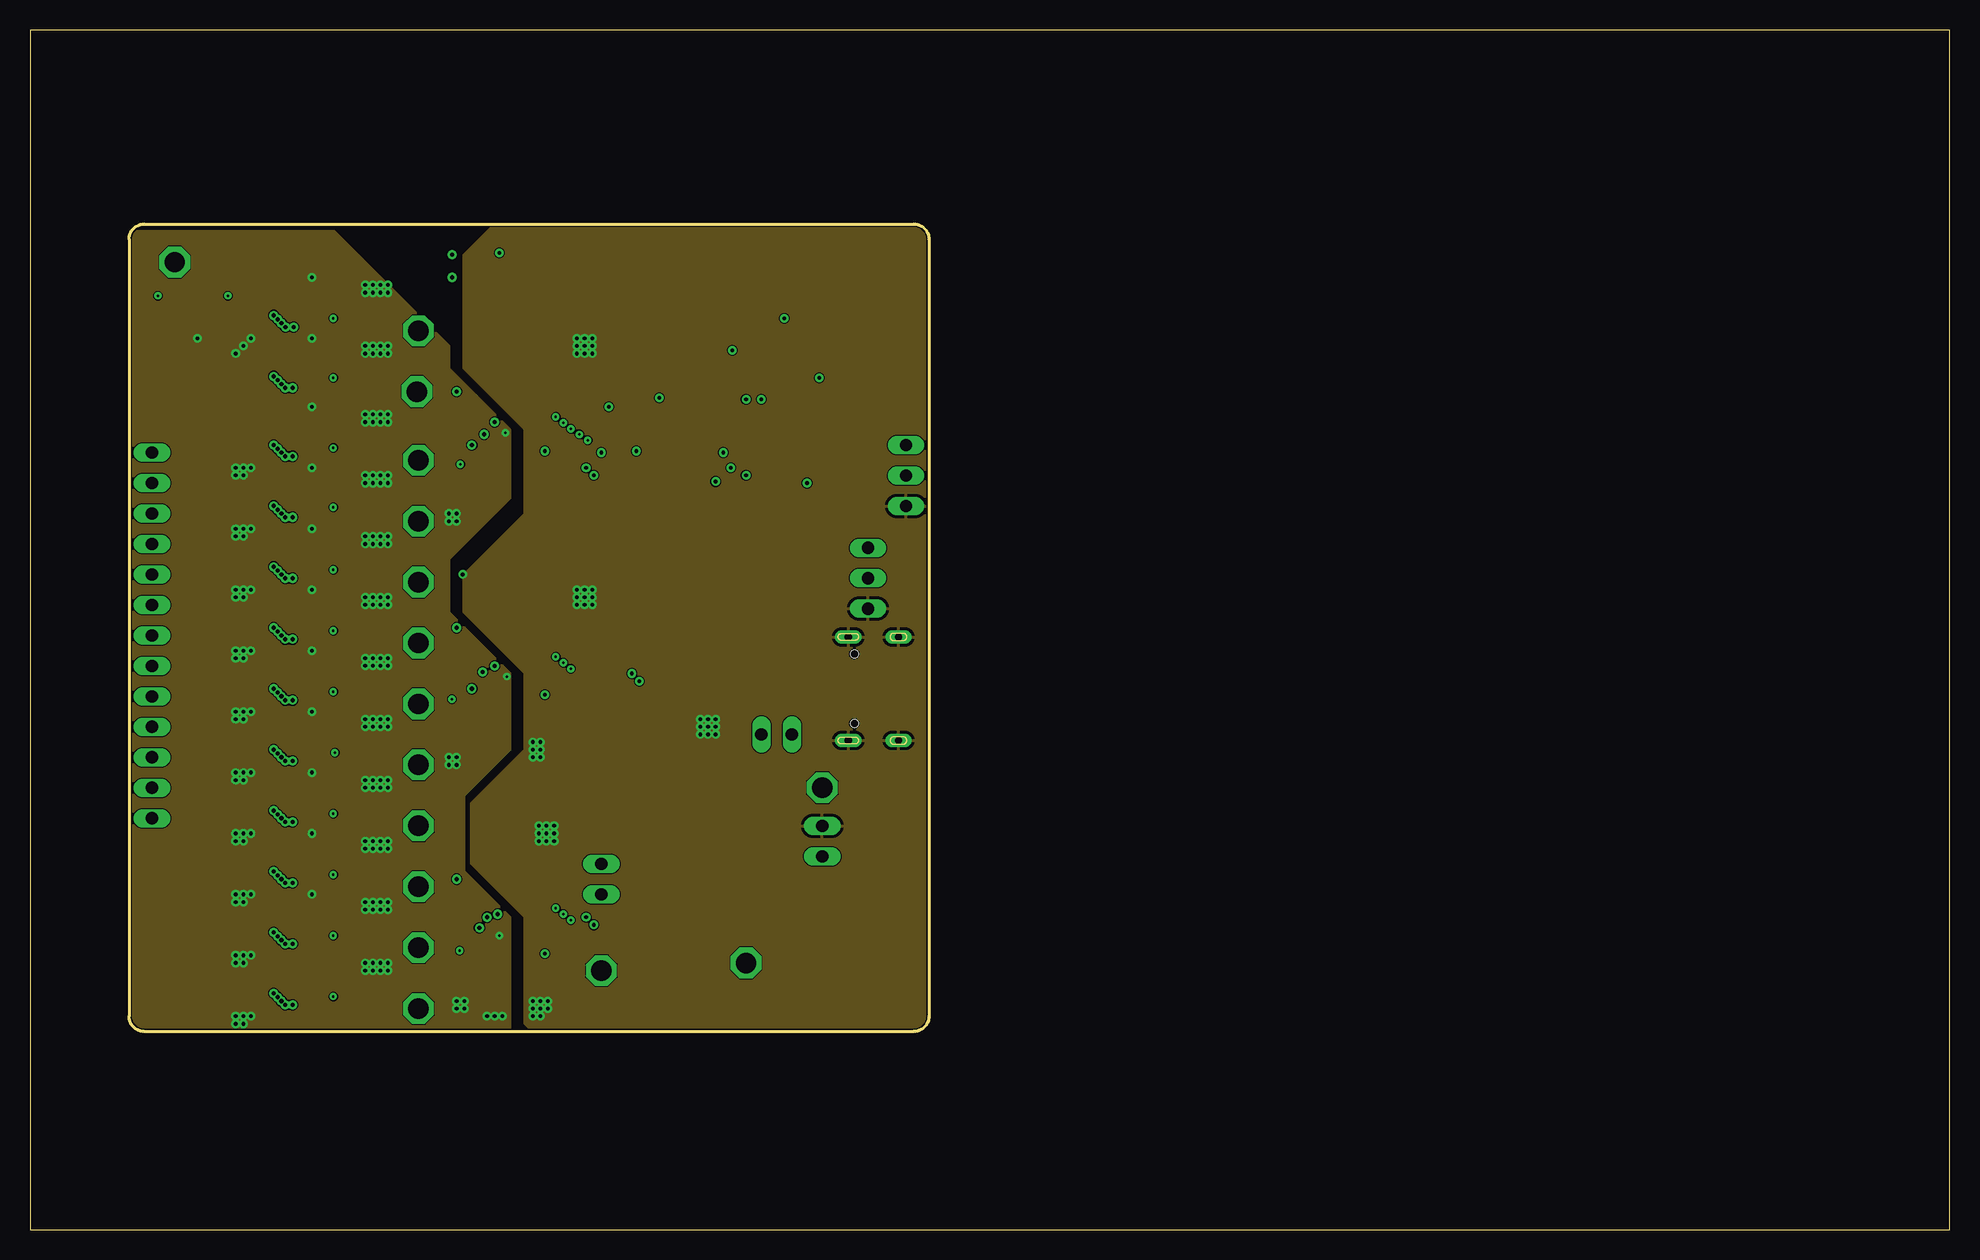
[diagram p4: board, inner layer Route15]
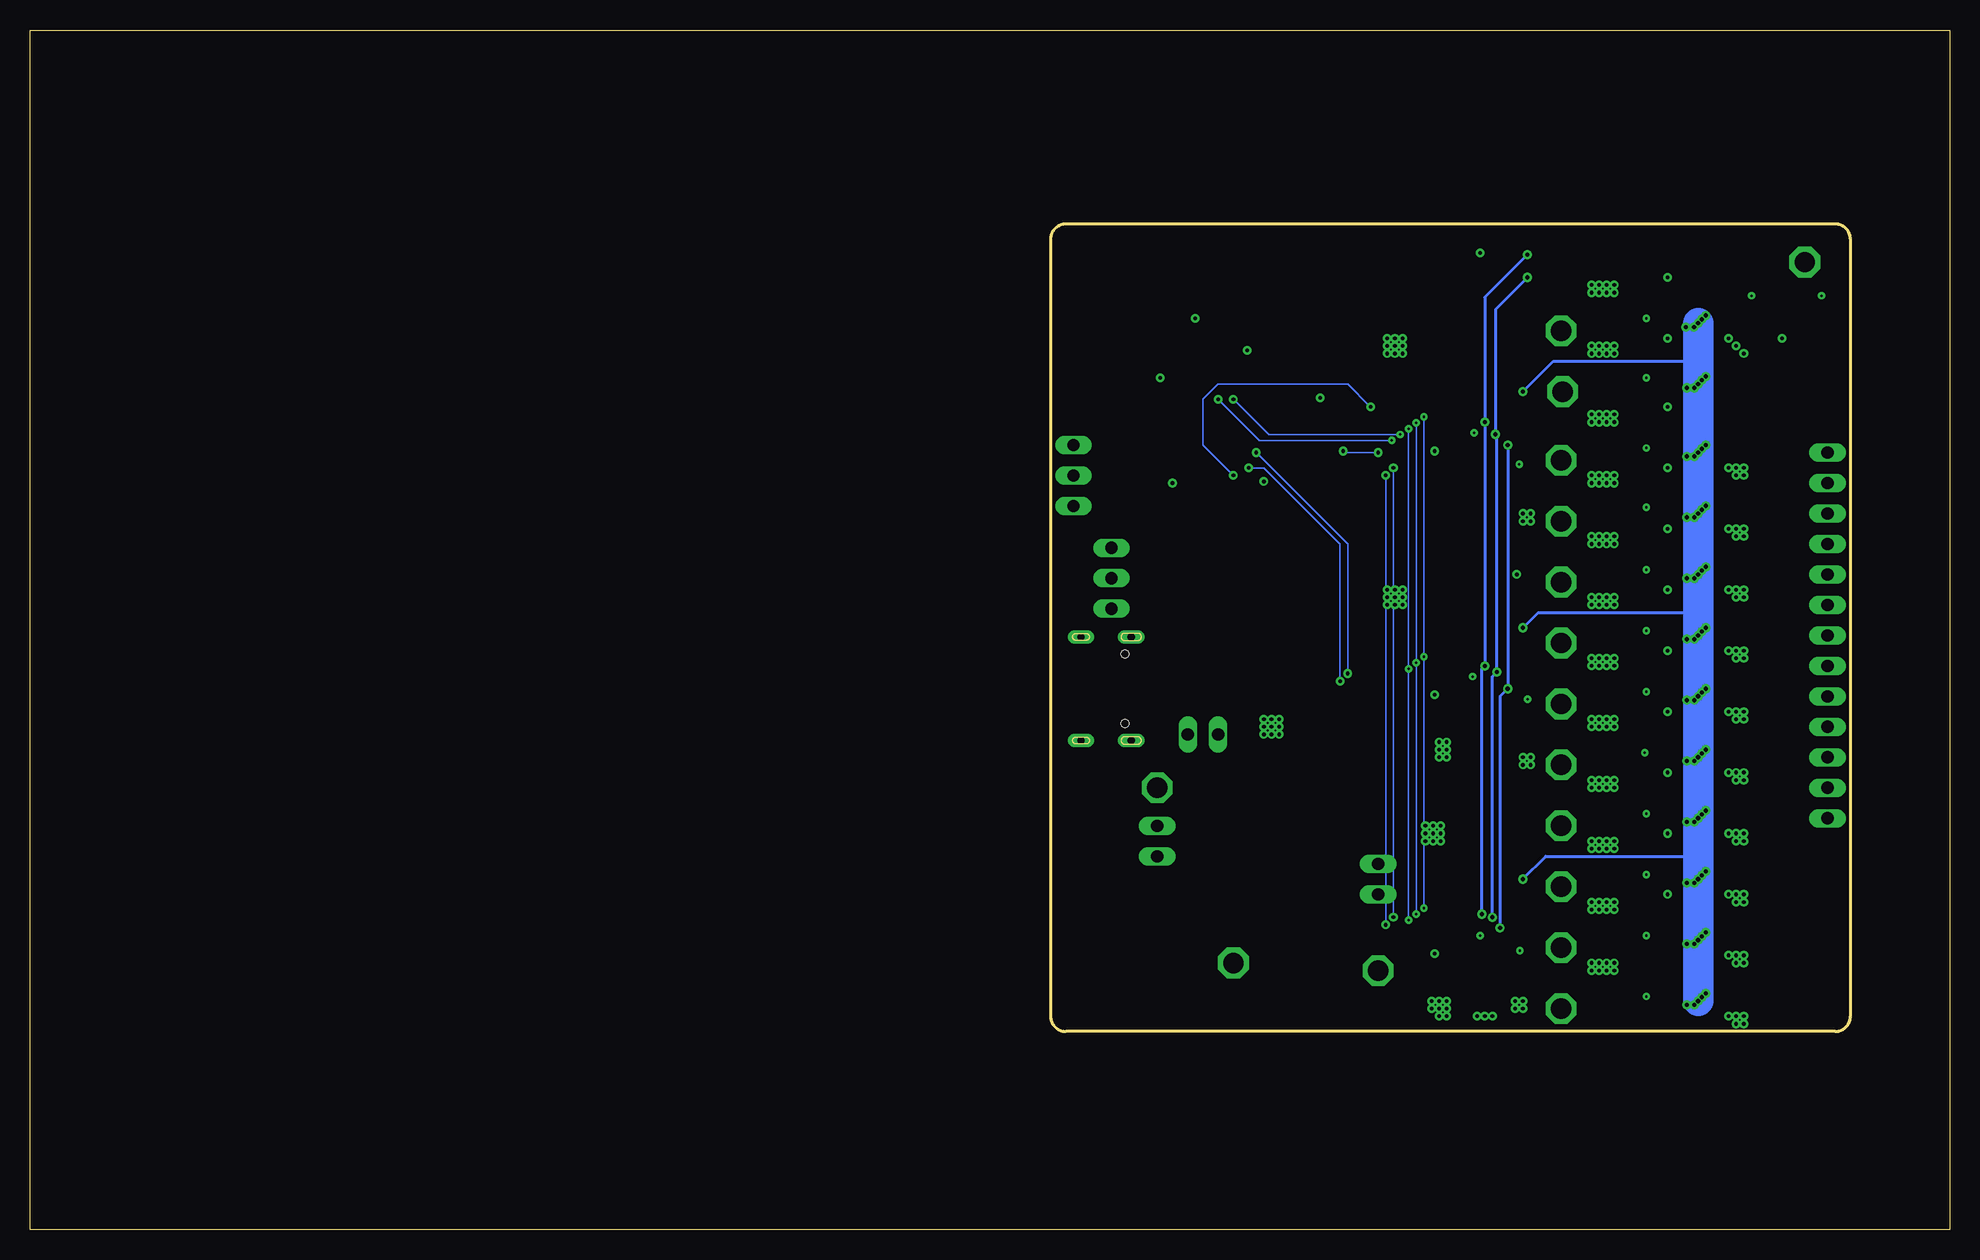
[diagram p5: board, bottom side, seen from below]

Size 160 x 100 mm. Coordinates in mm from the lower left corner, seen from the top.
Outline: 0,0 160,0 160,100 0,100 0,0
Outline: 8.26,82.55 8.26,17.78 arc90 9.53,16.51 73.66,16.51 arc90 74.93,17.78 74.93,82.55 arc90 73.66,83.82 9.53,83.82 arc90 8.26,82.55
Copper layers (1+2*15+16): Top 0.035mm / dielectric 1.5mm / Route2 0.035mm / dielectric 0.15mm / Route15 0.035mm / dielectric 0.2mm / Bottom 0.035mm
Design rules "default *": minimum track width 3.5mil, minimum drill 0.2mm, track to track 3.5mil, track to pad 3.5mil, pad to pad 3.5mil, via to via 3.5mil, smd to smd 0mil, copper to edge 0.1mm, drill to drill 10mil, minimum pad ring 10mil, minimum via ring 8mil, stop-mask expansion 4mil, vias tented up to drill 0mil, thermal gap 10mil

### Footprints (pad centres in the part's own frame; a part is rotated, then mirrored left to right if it is on the bottom)
C0603 = smd 1.1 x 1: 1 -0.85,0; 2 0.85,0
DO214AA = smd 1.8 x 2.2: A 2.55,0; C -2.55,0
TO252 = smd 1 x 1.6: 1 -2.28,-4.8; 2 2.28,-4.8 | smd 5.4 x 6.2: 3 0,2.5
SOT223 = smd 1.219 x 2.235: 1 -2.311,-3.099; 2 0,-3.099; 3 2.311,-3.099 | smd 3.6 x 2.2: 4 0,3.099
AMPHENOL_12402012E212A = smd 0.6 x 1.14: A1_B12 -3.2,4.75; A4_B9 -2.4,4.75; B1_A12 3.2,4.75; B4_A9 2.4,4.75 | smd 0.3 x 1.14: A5 -1.25,4.75; A6 -0.25,4.75; A7 0.25,4.75; A8 1.25,4.75; B5 1.75,4.75; B6 0.75,4.75; B7 -0.75,4.75; B8 -1.75,4.75 | drill 0.6 pad 1.05 long: SH1 -4.32,4.18; SH2 4.32,4.18 | drill 0.6 pad 0.9 long: SH3 -4.32,0; SH4 4.32,0 | hole 0.65: 2.89,3.68; -2.89,3.68
1X13 = drill 1.016 long: 1 -15.24,0; 2 -12.7,0; 3 -10.16,0; 4 -7.62,0; 5 -5.08,0; 6 -2.54,0; 7 0,0; 8 2.54,0; 9 5.08,0; 10 7.62,0; 11 10.16,0; 12 12.7,0; 13 15.24,0
1X02 = drill 1.016 long: 1 -1.27,0; 2 1.27,0
1X03 = drill 1.016 long: 1 -2.54,0; 2 0,0; 3 2.54,0
SML1206 = smd 1.5 x 1.5: A 1.75,0; C -1.75,0
R0603 = smd 1 x 1.1: 1 -0.85,0; 2 0.85,0
P1-17 = drill 1.702 pad 2.54 octagon: TP 0,0
SOP65P490X110-8N = smd 1.47 x 0.48: 1 -2.15,0.975; 2 -2.15,0.325; 3 -2.15,-0.325; 4 -2.15,-0.975; 5 2.15,-0.975; 6 2.15,-0.325; 7 2.15,0.325; 8 2.15,0.975
QFP50P700X700X120-32N = smd 1.44 x 0.26: 1 -3.195,1.75; 2 -3.195,1.25; 3 -3.195,0.75; 4 -3.195,0.25; 5 -3.195,-0.25; 6 -3.195,-0.75; 7 -3.195,-1.25; 8 -3.195,-1.75; 17 3.195,-1.75; 18 3.195,-1.25; 19 3.195,-0.75; 20 3.195,-0.25; 21 3.195,0.25; 22 3.195,0.75; 23 3.195,1.25; 24 3.195,1.75 | smd 0.26 x 1.44: 9 -1.75,-3.195; 10 -1.25,-3.195; 11 -0.75,-3.195; 12 -0.25,-3.195; 13 0.25,-3.195; 14 0.75,-3.195; 15 1.25,-3.195; 16 1.75,-3.195; 25 1.75,3.195; 26 1.25,3.195; 27 0.75,3.195; 28 0.25,3.195; 29 -0.25,3.195; 30 -0.75,3.195; 31 -1.25,3.195; 32 -1.75,3.195
SOT95P280X145-5N = smd 1.21 x 0.59: 1 -1.255,0.95; 2 -1.255,0; 3 -1.255,-0.95; 4 1.255,-0.95; 5 1.255,0.95
QFP50P1200X1200X160-64N = smd 1.5 x 0.3: 1 -5.7,3.75; 2 -5.7,3.25; 3 -5.7,2.75; 4 -5.7,2.25; 5 -5.7,1.75; 6 -5.7,1.25; 7 -5.7,0.75; 8 -5.7,0.25; 9 -5.7,-0.25; 10 -5.7,-0.75; 11 -5.7,-1.25; 12 -5.7,-1.75; 13 -5.7,-2.25; 14 -5.7,-2.75; 15 -5.7,-3.25; 16 -5.7,-3.75; 33 5.7,-3.75; 34 5.7,-3.25; 35 5.7,-2.75; 36 5.7,-2.25; 37 5.7,-1.75; 38 5.7,-1.25; 39 5.7,-0.75; 40 5.7,-0.25; 41 5.7,0.25; 42 5.7,0.75; 43 5.7,1.25; 44 5.7,1.75; 45 5.7,2.25; 46 5.7,2.75; 47 5.7,3.25; 48 5.7,3.75 | smd 0.3 x 1.5: 17 -3.75,-5.7; 18 -3.25,-5.7; 19 -2.75,-5.7; 20 -2.25,-5.7; 21 -1.75,-5.7; 22 -1.25,-5.7; 23 -0.75,-5.7; 24 -0.25,-5.7; 25 0.25,-5.7; 26 0.75,-5.7; 27 1.25,-5.7; 28 1.75,-5.7; 29 2.25,-5.7; 30 2.75,-5.7; 31 3.25,-5.7; 32 3.75,-5.7; 49 3.75,5.7; 50 3.25,5.7; 51 2.75,5.7; 52 2.25,5.7; 53 1.75,5.7; 54 1.25,5.7; 55 0.75,5.7; 56 0.25,5.7; 57 -0.25,5.7; 58 -0.75,5.7; 59 -1.25,5.7; 60 -1.75,5.7; 61 -2.25,5.7; 62 -2.75,5.7; 63 -3.25,5.7; 64 -3.75,5.7
OSCCC500X320X110-4N = smd 1.9 x 1.4: 1 -2.2,-1.2; 2 2.2,-1.2; 3 2.2,1.2; 4 -2.2,1.2

### Placement (x,y rotation side)
C1  24.77,77.47 90 top
C2  25.65,74.93 0 top
C3  29.08,76.71 180 top
C4  24.77,72.39 90 top
C5  25.65,69.85 0 top
C6  29.08,71.63 180 top
C7  24.77,66.67 90 top
C8  25.65,64.14 0 top
C9  29.08,65.91 180 top
C10  24.77,61.59 90 top
C11  25.65,59.05 0 top
C12  29.08,60.83 180 top
C13  24.77,56.52 90 top
C14  25.65,53.98 0 top
C15  29.08,55.75 180 top
C16  24.77,51.44 90 top
C17  25.65,48.9 0 top
C18  29.08,50.67 180 top
C19  24.77,46.35 90 top
C20  25.65,43.81 0 top
C21  29.08,45.59 180 top
C22  24.77,41.27 90 top
C23  25.65,38.73 0 top
C24  29.08,40.51 180 top
C25  24.77,36.2 90 top
C26  25.65,33.66 0 top
C27  29.08,35.43 180 top
C28  24.77,31.11 90 top
C29  25.65,28.57 0 top
C30  29.08,30.35 180 top
C31  24.77,26.04 90 top
C32  25.65,23.5 0 top
C33  29.08,25.27 180 top
C34  24.77,20.95 90 top
C35  25.65,18.41 0 top
C36  29.08,20.19 180 top
C37  35.5,61.91 90 top
C38  41.97,62.93 90 top
C39  39.56,61.15 90 top
C40  37.91,61.15 90 top
C41  36.89,73.98 90 top
C42  35.43,41.59 90 top
C43  41.59,42.86 90 top
C44  39.43,41.15 90 top
C45  37.72,40.45 90 top
C46  36.83,53.98 90 top
C47  35.81,21.21 90 top
C48  41.78,21.84 90 top
C49  39.75,19.94 90 top
C50  38.23,19.94 90 top
C51  37.08,32.77 90 top
C52  15.24,78.74 180 top
C53  11.43,74.93 0 top
C54  57.78,28.57 270 top
C55  50.16,28.57 270 top
C56  62.87,31.75 90 top
C57  60.33,31.75 90 top
C58  53.59,33.27 180 top
C59  53.72,35.56 180 top
C60  69.22,71.75 0 top
C61  66.04,58.74 0 top
C62  64.45,74.3 90 top
C63  69.22,70.17 0 top
C64  53.66,70.17 90 top
C65  55.31,60.39 270 top
C66  55.88,74.3 90 top
C67  57.47,74.3 90 top
C68  39.69,56.52 90 top
C69  39.69,53.34 270 top
C70  40.01,35.56 90 top
C71  40.01,32.38 270 top
C72  39.69,76.52 90 top
C73  39.69,73.34 270 top
D1  63.5,27.94 0 top
IC1  53.98,24.77 180 top
IC2  59.69,35.56 270 top
J1  72.39,45.09 90 top
JP1  10.16,49.53 90 top
JP2  66.04,32.38 270 top
JP3  73.03,62.87 90 top
JP4  69.85,54.29 90 top
JP5  47.62,29.21 90 top
JP6  62.23,41.27 180 top
LED1  63.5,25.4 180 top
LED2  49.91,20.95 90 top
LED3  50.8,33.66 90 top
LED4  48.9,56.2 90 top
LED5  51.12,56.2 90 top
LED6  53.34,56.2 90 top
R1  20.95,78.74 180 top
R2  29.21,74.93 0 top
R3  26.54,77.47 270 top
R4  20.95,73.66 180 top
R5  29.21,69.85 0 top
R6  26.54,72.39 270 top
R7  20.95,67.94 180 top
R8  29.21,64.14 0 top
R9  26.54,66.67 270 top
R10  20.95,62.87 180 top
R11  29.21,59.05 0 top
R12  26.54,61.59 270 top
R13  20.95,57.78 180 top
R14  29.21,53.98 0 top
R15  26.54,56.52 270 top
R16  20.95,52.7 180 top
R17  29.21,48.9 0 top
R18  26.54,51.44 270 top
R19  20.95,47.62 180 top
R20  29.21,43.81 0 top
R21  26.54,46.35 270 top
R22  20.95,42.55 180 top
R23  29.21,38.73 0 top
R24  26.54,41.27 270 top
R25  20.95,37.47 180 top
R26  29.21,33.66 0 top
R27  26.54,36.2 270 top
R28  20.95,32.38 180 top
R29  29.21,28.57 0 top
R30  26.54,31.11 270 top
R31  20.95,27.3 180 top
R32  29.21,23.5 0 top
R33  26.54,26.04 270 top
R34  20.95,22.23 180 top
R35  29.21,18.41 0 top
R36  26.54,20.95 270 top
R37  36.83,81.28 0 top
R38  36.83,79.38 0 top
R39  36.83,77.47 0 top
R40  33.66,81.28 0 top
R41  33.66,79.38 0 top
R42  33.66,77.47 0 top
R43  11.43,76.83 180 top
R44  11.43,73.03 0 top
R45  70.48,67.94 180 top
R46  61.59,74.93 270 top
R47  59.05,25.4 180 top
R48  50.16,25.4 90 top
R49  53.34,37.47 0 top
R50  48.9,60.64 90 top
R51  51.12,60.64 90 top
R52  53.28,60.64 90 top
R53  66.04,48.26 90 top
R54  66.04,42.55 90 top
TP1  59.69,22.23 0 top
TP2  47.62,21.59 0 top
TP3  66.04,36.83 0 top
TP4  32.38,74.93 0 top
TP5  32.26,69.85 0 top
TP6  32.38,64.14 0 top
TP7  32.38,59.05 0 top
TP8  32.38,53.98 0 top
TP9  32.38,48.9 0 top
TP10  32.38,43.81 0 top
TP11  32.38,38.73 0 top
TP12  32.38,33.66 0 top
TP13  32.38,28.57 0 top
TP14  32.38,23.5 0 top
TP15  32.38,18.41 0 top
TP16  12.06,80.64 0 top
U1  20.95,76.2 0 top
U2  20.95,71.12 0 top
U3  20.95,65.41 0 top
U4  20.95,60.33 0 top
U5  20.95,55.24 0 top
U6  20.95,50.16 0 top
U7  20.95,45.09 0 top
U8  20.95,40.01 0 top
U9  20.95,34.92 0 top
U10  20.95,29.84 0 top
U11  20.95,24.77 0 top
U12  20.95,19.68 0 top
U13  38.42,66.99 0 top
U14  38.42,46.99 0 top
U15  38.73,26.04 0 top
U16  15.24,76.2 0 top
U17  60.96,66.04 270 top
Y1  42.86,73.98 90 top
Y2  42.86,53.98 90 top
Y3  43.18,33.02 90 top

### Tracks (layer width: path | path; a pad name or v marks a point on that pad's centre or on a via)
2V5  (via drill 0.35)
  Top 0.127: JP1.13 10.16,69.22 16.2,75.25 U16.4
  Top 0.152: TP16.TP 12.06,78.74 13.65,77.15 U16.1
  Top 0.254: U15.7 36.47,24.79 36.58,24.89 36.58,25.78 | 36.58,25.78 36.58,26.8 | 36.58,26.8 36.58,27.94 | U15.1 36.42,27.79 36.58,27.94 | U15.3 36.56,26.79 36.58,26.8 | U15.5 36.57,25.79 36.58,25.78 | U13.7 36.02,65.74 36.26,65.98 36.26,66.74 | 36.26,66.74 36.26,67.75 | 36.26,67.75 36.26,68.64 | U13.1 36.16,68.74 36.26,68.64 | U13.3 36.25,67.74 36.26,67.75 | U13.5 36.26,66.74 | U14.7 36.02,45.74 36.26,45.97 36.26,46.74 | 36.26,46.74 36.26,47.75 | 36.26,47.75 36.26,48.77 | U14.1 36.23,48.74 36.26,48.77 | U14.3 36.25,47.74 36.26,47.75 | U14.5 36.26,46.74 | U16.1 15.31,77.15 16.51,75.95 U16.4 | U16.4 | U16.4 16.83,75.25 17.14,75.56 17.14,76.2 17.47,76.53 U1.2 | v35.56,69.85 36.26,69.15 36.26,68.64 | 36.26,48.77 36.26,49.47 v35.56,50.16 | 36.58,27.94 36.58,28.19 v35.56,29.21
  Top 0.381: U2.2 20,71.44 v20.32,71.12 v20.64,70.8 v20.95,70.48 v21.27,70.17 v21.91,70.17 21.93,70.14 U2.5 | U1.2 20,76.53 v20.32,76.2 v20.64,75.88 v20.95,75.56 v21.3,75.22 v21.97,75.22 U1.5 | U3.2 20,65.73 v20.32,65.41 v20.64,65.09 v20.95,64.77 v21.27,64.45 v21.91,64.45 21.93,64.43 U3.5 | U4.2 20,60.65 v20.32,60.33 v20.64,60.01 v20.95,59.69 v21.27,59.37 21.3,59.35 21.89,59.35 v21.91,59.37 21.93,59.35 U4.5 | U5.2 20,55.57 v20.32,55.24 v20.64,54.93 v20.95,54.61 v21.27,54.29 v21.91,54.29 21.93,54.27 U5.5 | U6.2 20,50.49 v20.32,50.16 v20.64,49.85 v20.95,49.53 v21.27,49.21 21.3,49.19 21.89,49.19 v21.91,49.21 21.93,49.19 U6.5 | U7.2 20,45.41 v20.32,45.09 v20.64,44.77 v20.95,44.45 v21.27,44.13 v21.91,44.13 21.93,44.11 U7.5 | U8.2 20,40.33 v20.32,40.01 v20.64,39.69 v20.95,39.37 v21.27,39.05 v21.91,39.05 21.93,39.03 U8.5 | U9.2 20,35.25 v20.32,34.92 v20.64,34.61 v20.95,34.29 v21.27,33.97 v21.91,33.97 21.93,33.95 U9.5 | U10.2 20,30.17 v20.32,29.84 v20.64,29.53 v20.95,29.21 v21.27,28.89 v21.91,28.89 21.93,28.87 U10.5 | U11.2 20,25.09 v20.32,24.77 v20.64,24.45 v20.95,24.13 v21.27,23.81 v21.91,23.81 21.93,23.79 U11.5 | U12.2 20,20.01 v20.32,19.68 v20.64,19.37 v20.95,19.05 v21.27,18.73 v21.91,18.73 21.93,18.71 U12.5
  Bottom 0.254: v35.56,69.85 33.02,72.39 20.95,72.39 | v35.56,29.21 33.66,31.11 20.95,31.11 | v35.56,50.16 34.29,51.44 20.95,51.44
  Bottom 2.54: v20.95,75.56 20.95,72.39 v20.95,70.48 v20.95,64.77 v20.95,59.69 v20.95,54.61 20.95,51.44 v20.95,49.53 v20.95,44.45 v20.95,39.37 v20.95,34.29 20.95,31.11 v20.95,29.21 v20.95,24.13 v20.95,19.05
3V3  (via drill 0.3 pad 0.61)
  Top 0.254: U15.29 38.48,28.19 39.98,26.69 U15.15 U15.16 40.63,22.69 C48.2 | C48.2 41.78,24.14 U15.17 | C61.1 64.71,58.38 U17.48 64.71,62.17 v64.77,62.23 | C62.1 64.71,73.19 U17.1 65.04,71.74 v65.79,70.99 66.67,70.1 66.67,69.79 | 66.67,69.79 67.99,69.79 C63.1 C60.1 | 66.67,69.79 U17.64 | C66.1 C67.1 58.27,73.44 58.71,73.01 | U17.13 58.71,73.01 | U17.19 54.08,68.79 53.98,68.9 53.98,69 C64.1 53.63,69.34 v52.45,69.34 | 41.59,43.81 C43.2 40.25,43.71 U14.16 U14.15 39.67,44.68 40.56,45.57 40.56,46.44 38.17,48.83 U14.29 | 41.59,43.81 41.59,45.22 U14.17 | C38.2 40.19,63.78 U13.16 U13.15 39.67,65.07 40.3,65.7 40.3,67.01 38.17,69.15 U13.29 | U13.17 41.61,64.14 C38.2 | C65.1 55.26,61.29 55.26,62.23 | 55.26,62.23 U17.32 | R39.2 R38.2 R37.2 38.99,81.28 v39.12,81.41 | v57.15,62.36 57.02,62.23 55.26,62.23 | v58.55,73.28 58.71,73.12 58.71,73.01 | v62.87,75.95 61.76,75.95 R46.1 | C38.2 42.93,64.73 v42.93,64.9 | v42.93,44.58 42.93,43.94 42.8,43.81 41.59,43.81 | v42.93,22.99 42.63,22.69 C48.2 | TP3.TP 63.5,39.37 JP6.1 63.5,41.91 61.59,43.81 60.33,43.81 59.05,42.55 59.05,40.64 57.78,39.37 55.24,39.37 54.19,38.31 R49.2 54.57,37.08 C59.1
  pour Route2: 41.91,8.26 41.91,12.06 41.27,12.7 41.27,26.04 37.47,29.84 37.47,36.2 38.73,37.47 41.27,40.01 41.27,41.27 41.27,46.35 37.47,50.16 37.47,55.88 40.64,59.05 41.27,59.69 41.27,60.96 41.27,66.67 38.73,69.22 37.47,70.48 37.47,74.3 37.47,85.72 41.91,90.17 49.53,97.79 58.42,97.79 93.98,97.79 96.52,95.25 107.31,84.45 107.31,36.83 107.31,24.13 97.79,14.61 89.53,6.35 43.81,6.35
5V  (via drill 0.2 pad 0.46)
  Top 0.254: C52.1 16.5,78.33 v16.5,77.85 U16.5 | C42.2 35.56,42.57 35.56,43.56 35.69,43.69 | 35.69,43.69 35.79,43.8 U14.9 | C37.2 35.56,62.83 35.56,63.5 v35.86,63.8 U13.9 | R43.2 10.58,77.76 v10.67,77.85 | C4.1 25.27,71.03 v25.27,70.99 | C1.1 25.27,76.11 v25.27,75.95 | C7.1 25.27,65.32 v25.27,65.15 | C10.1 25.27,60.24 v25.27,60.2 | C13.1 25.27,55.16 v25.27,54.99 | C16.1 25.27,50.08 v25.27,49.91 | C19.1 25.27,45 v25.27,44.83 | C22.1 25.27,39.92 25.27,39.75 v25.4,39.75 | C25.1 25.27,34.84 v25.27,34.67 | C28.1 25.27,29.76 v25.27,29.59 | C31.1 25.27,24.68 v25.27,24.51 | C34.1 25.27,19.6 v25.27,19.43 | R48.2 49.11,26.25 | 49.11,26.25 47.62,24.77 TP2.TP 43.18,17.14 37.47,17.14 36.98,17.62 U15.9 36.59,22.84 C47.2 v35.81,23.24 | v35.18,44.2 35.69,43.69 | C55.1 48.68,27.94 JP5.1 48.26,27.94 49.11,27.09 49.11,26.25
  Top 0.381: U1.7 24.67,76.53 C1.1 | C4.1 24.67,71.44 U2.7 | C7.1 24.67,65.73 U3.7 | C10.1 24.67,60.65 U4.7 | C13.1 24.67,55.57 U5.7 | C16.1 24.67,50.49 U6.7 | C19.1 24.67,45.41 U7.7 | C22.1 24.67,40.33 U8.7 | C25.1 24.67,35.25 U9.7 | C28.1 24.67,30.17 U10.7 | C31.1 24.67,25.09 U11.7 | C34.1 24.67,20.01 U12.7
  pour Route2: 36.83,16.51 36.83,93.34 29.84,100.33 -9.53,100.33 -14.61,95.25 -14.61,0 -6.35,-8.26 33.66,-8.26 36.2,-5.71 36.83,-5.08
9V
  Top 0.254: TP1.TP 58.41,23.5 58.41,25.4
  Top 0.381: C58.1 56.57,33.27 IC2.3 56.59,29.9 IC1.1 56.4,29.43 C54.1 59.26,30.9 C57.1 60.96,30.9 | C56.1 60.96,30.9 | 60.96,30.9 60.95,30.89 D1.C 58.41,25.4 R47.2
ADC0
  Top 0.254: R2.2 TP4.TP 34.16,73.15 34.16,68.45 34.37,68.24 U13.2
  Top 0.381: C3.1 29.93,75.06 R2.2
ADC0_CS  (via drill 0.3 pad 0.61)
  Top 0.127: U13.23 47.92,68.24 v48.26,68.58 | v59.69,62.87 59.21,62.38 U17.37
  Bottom 0.127: v48.26,68.58 50.16,70.48 60.96,70.48 62.23,69.22 62.23,65.41 v59.69,62.87
ADC0_DONE  (via drill 0.2 pad 0.46, 0.3 pad 0.61)
  Top 0.127: U13.18 46.44,65.74 v46.48,65.79 | v60.96,69.22 61.21,69.47 U17.8
  Bottom 0.127: v46.48,65.79 57.53,65.79 v60.96,69.22
ADC0_DRDY  (via drill 0.2 pad 0.46, 0.3 pad 0.61)
  Top 0.127: U13.19 45.8,66.24 45.8,66.26 v45.78,66.27 | v59.69,69.22 60.71,70.23 U17.9
  Bottom 0.127: v45.78,66.27 56.75,66.27 v59.69,69.22
ADC1
  Top 0.254: U13.4 32.96,67.24 32.26,67.94 TP5.TP R5.2
  Top 0.381: C6.1 30.06,71.5 R5.2
ADC1_CS
  Top 0.127: U14.23 58.4,48.24 59.69,49.53 59.69,60.32 U17.38
ADC1_DONE  (via drill 0.3 pad 0.61)
  Top 0.127: U14.18 50.78,45.74 v50.8,45.72 | v58.42,63.5 58.42,68.83 60.21,70.62 U17.10
  Bottom 0.127: v50.8,45.72 50.8,57.15 57.15,63.5 v58.42,63.5
ADC1_DRDY  (via drill 0.3 pad 0.61)
  Top 0.127: U14.19 50.05,46.24 v50.16,46.35 | U17.11 59.71,70.76 57.78,68.83 v57.78,64.77
  Bottom 0.127: v50.16,46.35 50.16,57.15 v57.78,64.77
ADC2
  Top 0.254: U13.6 32.59,66.24 32.38,66.04 TP6.TP R8.2
  Top 0.381: C9.1 30.06,65.79 R8.2
ADC2_CS
  Top 0.127: U15.23 41.95,27.3 43.81,27.3 45.72,29.21 45.72,34.29 60.21,48.78 U17.39
ADC2_DONE  (via drill 0.3 pad 0.61)
  Top 0.127: U15.18 46.38,24.79 v46.99,25.4 | U17.24 50.41,66.29 v46.99,62.87
  Bottom 0.127: v46.99,25.4 v46.99,62.87
ADC2_DRDY  (via drill 0.3 pad 0.61)
  Top 0.127: U15.19 45.6,25.29 v46.35,26.04 | v46.35,63.5 v47.62,64.77 | v50.55,64.9 51.44,65.79 U17.25
  Bottom 0.127: v46.35,26.04 v46.35,63.5 | v50.55,64.9 50.42,64.77 v47.62,64.77
ADC3
  Top 0.254: U13.8 34.64,65.24 34.29,64.9 34.29,60.96 TP7.TP R11.2
  Top 0.381: C12.1 30.06,60.71 R11.2
ADC4
  Top 0.254: U14.2 34.31,48.24 34.04,48.51 34.04,52.32 TP8.TP R14.2
  Top 0.381: C15.1 30.06,55.63 R14.2
ADC5
  Top 0.254: U14.4 34.04,47.24 TP9.TP R17.2
  Top 0.381: C18.1 30.06,50.55 R17.2
ADC6
  Top 0.254: U14.6 32.91,46.24 32.38,45.72 TP10.TP R20.2
  Top 0.381: C21.1 30.06,45.47 R20.2
ADC7
  Top 0.254: U14.8 34.7,45.24 34.29,44.83 34.29,40.64 TP11.TP R23.2
  Top 0.381: C24.1 30.06,40.39 R23.2
ADC8
  Top 0.254: U15.2 34.69,27.29 34.29,27.69 34.29,31.75 TP12.TP R26.2
  Top 0.381: C27.1 30.06,35.31 R26.2
ADC9
  Top 0.254: U15.4 34.67,26.29 TP13.TP R29.2
  Top 0.381: C30.1 30.06,30.23 R29.2
ADC10
  Top 0.254: U15.6 34.17,25.29 TP14.TP R32.2
  Top 0.381: C33.1 30.06,25.15 R32.2
ADC11
  Top 0.254: U15.8 34.95,24.29 34.67,24 34.67,20.7 TP15.TP R35.2
  Top 0.381: C36.1 30.06,20.07 R35.2
ADC_DIN  (via drill 0.2 pad 0.46)
  Top 0.127: U13.20 v45.09,66.74 55.21,66.74 U17.23 | U15.20 v45.08,25.79 v45.09,25.78 | U14.20 v45.08,46.74 v45.09,46.74
  Bottom 0.127: v45.09,66.74 v45.09,46.74 v45.09,25.78
ADC_DOUT  (via drill 0.2 pad 0.46)
  Top 0.127: U13.21 v44.45,67.24 55.21,67.24 U17.22 | U15.21 v44.45,26.29 | U14.21 v44.45,47.24
  Bottom 0.127: v44.45,67.24 v44.45,47.24 v44.45,26.29
ADC_MODE_0  (via drill 0.35)
  Top 0.254: U13.30 37.67,68.38 v38.73,67.31 | U14.30 37.67,48.06 v38.73,46.99 | U15.30 37.98,27.29 v38.99,26.29 | R40.2 v35.18,81.28 R37.1
  Bottom 0.254: v38.99,26.29 38.99,46.74 v38.73,46.99 v38.73,67.31 38.73,77.72 v35.18,81.28
ADC_MODE_1  (via drill 0.35)
  Top 0.254: U13.31 37.17,66.97 v37.85,66.29 | U14.31 37.17,47.03 v37.72,46.48 | U15.31 37.48,26.65 v38.1,26.04 | R38.1 v35.18,79.38 R41.2
  Bottom 0.254: v38.1,26.04 38.1,46.1 v37.72,46.48 37.72,66.17 v37.85,66.29 37.85,76.71 v35.18,79.38
ADC_MODE_2  (via drill 0.35)
  Top 0.254: v36.83,65.41 36.67,65.57 U13.32 36.67,71.46 35.98,72.14 R39.1 R42.2 | U14.32 36.67,45.25 v36.83,45.09 | U15.32 36.98,25.63 v37.47,25.15
  Bottom 0.254: v36.83,65.41 v36.83,45.09 37.47,44.45 v37.47,25.15
ADC_SCLK  (via drill 0.2 pad 0.46)
  Top 0.127: U13.22 v43.81,67.74 55.21,67.74 U17.21 | U15.22 43.8,26.79 v43.81,26.8 | U14.22 v43.8,47.74 v43.81,47.75
  Bottom 0.127: v43.81,67.74 v43.81,47.75 v43.81,26.8
GND  (via drill 0.2 pad 0.46, 0.3 pad 0.61)
  Top 0.254: R42.1 R41.1 R40.1 32.8,82.33 33.02,82.55 43.18,82.55 44.06,81.67 Y1.2 | C49.1 41.87,19.09 v41.91,19.05 41.91,20.87 C48.1 | v36.07,54.61 36.28,54.83 C46.2 | U14.11 37.67,44.65 38.1,45.09 38.73,45.09 38.67,45.02 U14.13 | U13.11 37.67,64.97 38.1,65.41 38.73,65.41 38.67,65.34 U13.13 | U15.11 37.98,24.02 38.1,24.13 38.73,24.13 38.98,23.88 U15.13 | C45.1 38.42,40.3 C44.1 | J1.A1_B12 68.21,41.31 J1.SH1 | J1.B1_A12 68.21,48.85 J1.SH2
  other vias: 39.12,24.51 39.75,46.1 39.62,66.42 27.94,73.66 28.57,73.66 29.21,73.66 29.84,73.66 29.21,73.03 29.84,73.03 28.57,73.03 27.94,73.03 27.94,67.94 27.94,67.31 28.57,67.94 29.21,67.94 29.84,67.94 29.84,67.31 29.21,67.31 28.57,67.31 27.94,62.23 28.57,62.23 29.21,62.23 29.84,62.23 29.84,62.87 29.21,62.87 28.57,62.87 27.94,62.87 27.94,57.15 27.94,57.78 28.57,57.78 29.21,57.78 29.84,57.78 29.84,57.15 29.21,57.15 28.57,57.15 27.94,52.07 27.94,52.7 28.57,52.7 28.57,52.07 29.21,52.07 29.21,52.7 29.84,52.7 29.84,52.07 27.94,46.99 27.94,47.62 28.57,47.62 28.57,46.99 29.21,46.99 29.21,47.62 29.84,47.62 29.84,46.99 27.94,42.55 27.94,41.91 28.57,41.91 28.57,42.55 29.21,42.55 29.21,41.91 29.84,41.91 29.84,42.55 27.94,37.47 27.94,36.83 28.57,36.83 29.21,36.83 29.84,36.83 29.84,37.47 29.21,37.47 28.57,37.47 27.94,32.38 27.94,31.75 28.57,31.75 28.57,32.38 29.21,32.38 29.21,31.75 29.84,31.75 29.84,32.38 27.94,27.3 27.94,26.67 28.57,26.67 28.57,27.3 29.21,27.3 29.21,26.67 29.84,26.67 29.84,27.3 27.94,21.59 27.94,22.23 28.57,22.23 28.57,21.59 29.21,21.59 29.21,22.23 29.84,22.23 29.84,21.59 23.5,27.94 23.5,33.02 23.5,38.1 23.5,43.18 23.5,48.26 23.5,53.34 23.5,58.42 23.5,63.5 23.5,68.58 23.5,74.3 27.94,78.11 28.57,78.11 29.21,78.11 29.84,78.11 29.84,78.74 27.94,78.74 28.57,78.74 29.21,78.74 23.5,79.38 18.41,74.3 17.78,73.66 17.14,73.03 18.41,63.5 17.78,62.87 17.78,63.5 17.14,63.5 17.14,62.87 18.41,58.42 17.78,58.42 17.14,58.42 17.14,57.78 17.78,57.78 18.41,53.34 17.78,53.34 17.14,53.34 17.14,52.7 17.78,52.7 18.41,48.26 17.78,48.26 17.14,48.26 17.14,47.62 17.78,47.62 18.41,43.18 17.78,43.18 17.14,43.18 17.14,42.55 17.78,42.55 18.41,38.1 17.78,38.1 17.14,38.1 17.14,37.47 17.78,37.47 18.41,33.02 17.78,33.02 17.14,33.02 17.14,32.38 17.78,32.38 18.41,27.94 17.78,27.94 17.14,27.94 17.14,27.3 17.78,27.3 18.41,22.86 17.78,22.86 17.14,22.86 17.14,22.23 17.78,22.23 18.41,17.78 17.78,17.78 17.14,17.78 17.14,17.14 17.78,17.14 13.97,74.3 38.73,17.78 39.37,17.78 38.1,17.78 35.56,19.05 36.2,19.05 36.2,18.41 35.56,18.41 35.56,39.37 34.92,39.37 34.92,38.73 35.56,38.73 35.56,59.69 34.92,59.69 34.92,59.05 35.56,59.05 41.91,39.37 41.91,40.01 41.91,40.64 55.88,42.55 55.88,41.91 55.88,41.27 56.52,41.27 56.52,41.91 56.52,42.55 57.15,42.55 57.15,41.91 57.15,41.27 42.55,39.37 42.55,40.01 42.55,40.64 41.91,18.41 41.91,17.78 42.55,17.78 42.55,18.41 42.55,19.05 43.18,19.05 43.18,18.41 45.59,53.34 46.23,53.34 46.23,52.7 45.59,52.7 45.59,52.07 46.23,52.07 46.86,52.07 46.86,52.7 46.86,53.34 45.59,74.3 45.59,73.66 45.59,73.03 46.23,73.03 46.23,73.66 46.23,74.3 46.86,74.3 46.86,73.66 46.86,73.03 42.42,33.66 42.42,33.02 42.42,32.38 43.05,33.66 43.05,33.02 43.05,32.38 43.69,32.38 43.69,33.02 43.69,33.66
  pour Route15: 41.27,17.14 41.27,26.04 36.83,30.48 36.83,35.56 41.27,40.01 41.27,46.35 36.2,51.44 36.2,54.61 41.27,59.69 41.27,66.67 36.2,71.75 36.2,81.28 41.91,87 86.36,87 95.25,78.11 95.25,27.3 81.92,13.97 44.45,13.97
  pour Top (isolate 0.127): 43.81,10.16 41.27,12.7 41.27,26.04 36.83,30.48 36.83,35.56 41.27,40.01 41.27,46.35 36.2,51.44 36.2,54.61 41.27,59.69 41.27,66.67 36.2,71.75 36.2,81.28 50.16,95.25 89.53,95.25 100.33,84.45 100.33,34.29 76.2,10.16
  pour Top: 40.01,10.16 40.01,26.04 36.2,29.84 36.2,36.2 40.01,40.01 40.01,46.35 34.92,51.44 34.92,55.88 40.01,60.96 40.01,66.67 35.56,71.12 35.56,73.03 24.13,84.45 2.54,84.45 -1.91,80.01 -1.91,10.79 3.17,5.71 35.56,5.71
  pour Route15: 40.01,6.35 40.01,26.04 36.2,29.84 36.2,36.2 40.01,40.01 40.01,46.35 34.92,51.44 34.92,55.88 40.01,60.96 40.01,66.67 34.92,71.75 34.92,73.66 25.4,83.19 1.27,83.19 -1.91,80.01 -1.91,10.79 6.35,2.54 36.2,2.54
LEAD0
  Top 0.127: JP1.12 12.06,62.23 12.7,62.87 12.7,69.85 17.78,74.93 17.78,75.69 17.96,75.88 U1.3
LEAD1
  Top 0.127: JP1.11 12.06,59.69 13.97,61.59 13.97,69.22 15.55,70.8 U2.3
LEAD2
  Top 0.127: JP1.10 12.06,57.15 15.24,60.33 15.24,64.14 16.18,65.08 U3.3
LEAD3
  Top 0.127: JP1.9 12.06,54.61 17.45,60 U4.3
LEAD4
  Top 0.127: U5.3 16.18,54.92 13.34,52.07 JP1.8
LEAD5
  Top 0.127: JP1.7 15.24,49.53 15.55,49.84 U6.3
LEAD6
  Top 0.127: JP1.6 12.06,46.99 14.29,44.76 U7.3
LEAD7
  Top 0.127: JP1.5 12.06,44.45 16.84,39.68 U8.3
LEAD8
  Top 0.127: JP1.4 12.06,41.91 16.51,37.47 16.51,35.56 17.47,34.6 U9.3
LEAD9
  Top 0.127: JP1.3 12.06,39.37 14.61,36.83 14.61,31.11 16.2,29.52 U10.3
LEAD10
  Top 0.127: JP1.2 12.06,36.83 12.7,36.2 12.7,27.94 16.2,24.44 U11.3
LEAD11
  Top 0.127: JP1.1 10.16,25.4 16.2,19.36 U12.3
LED0
  Top 0.254: R50.2 48.9,62.23 51.95,65.29 U17.26
LED1
  Top 0.254: R51.2 51.12,63.18 52.73,64.79 U17.27
LED2
  Top 0.254: R52.2 53.28,63.44 54.13,64.29 U17.28
N$1
  Top 0.381: R1.2 19.05,78.74 18.8,78.5 U1.1
N$2
  Top 0.381: R1.1 22.86,78.74 23.11,78.5 U1.8
N$3
  Top 0.381: U1.6 23.86,75.88 C2.1
N$4
  Top 0.381: R3.2 26.5,76.58 C2.2 R2.1
N$5
  Top 0.381: JP2.2 D1.A
N$6
  Top 0.254: U13.28 38.67,71.19 36.89,72.96 C41.1
N$7
  Top 0.254: Y1.3 40.47,77.37 C72.2 38.29,75.97 38.29,72.45 39.67,71.08 U13.26
N$8
  Top 0.254: C73.2 40.17,72.01 U13.25 42.88,70.19 44.06,71.37 Y1.1
N$9
  Top 0.254: C40.2 38.17,62.26 U13.12
N$10
  Top 0.254: C39.2 39.17,62.39 U13.14
N$11
  Top 0.381: R4.2 19.05,73.66 18.8,73.42 U2.1
N$12
  Top 0.381: U2.8 23.11,73.29 22.73,73.66 R4.1
N$13
  Top 0.381: U2.6 23.86,70.8 C5.1
N$14
  Top 0.381: R6.2 26.54,69.89 C5.2 R5.1
N$15
  Top 0.381: R7.2 19.05,67.94 18.8,67.7 U3.1
N$16
  Top 0.381: R7.1 22.86,67.94 23.11,67.7 U3.8
N$17
  Top 0.381: C8.1 23.86,65.08 U3.6
N$18
  Top 0.381: R8.1 C8.2 26.54,64.17 R9.2
N$19
  Top 0.381: R10.2 19.05,62.87 18.8,62.62 U4.1
N$20
  Top 0.381: R10.1 22.86,62.87 23.11,62.62 U4.8
N$21
  Top 0.381: C11.1 23.86,60 U4.6
N$22
  Top 0.381: R11.1 C11.2 26.54,59.09 R12.2
N$23
  Top 0.381: R13.2 19.05,57.78 18.8,57.54 U5.1
N$24
  Top 0.381: R13.1 22.86,57.78 23.11,57.54 U5.8
N$25
  Top 0.381: C14.1 23.86,54.92 U5.6
N$26
  Top 0.381: R14.1 C14.2 26.54,54.01 R15.2
N$27
  Top 0.381: R16.2 19.05,52.7 18.8,52.46 U6.1
N$28
  Top 0.381: R16.1 22.86,52.7 23.11,52.46 U6.8
N$29
  Top 0.381: C17.1 23.86,49.84 U6.6
N$30
  Top 0.381: R17.1 C17.2 26.5,50.55 R18.2
N$31
  Top 0.381: R19.2 19.05,47.62 18.8,47.38 U7.1
N$32
  Top 0.381: R19.1 22.86,47.62 23.11,47.38 U7.8
N$33
  Top 0.381: C20.1 23.86,44.76 U7.6
N$34
  Top 0.381: R20.1 C20.2 26.5,45.47 R21.2
N$35
  Top 0.381: R22.2 19.05,42.55 18.8,42.3 U8.1
N$36
  Top 0.381: R22.1 22.86,42.55 23.11,42.3 U8.8
N$37
  Top 0.381: C23.1 23.86,39.68 U8.6
N$38
  Top 0.381: R23.1 C23.2 26.54,38.77 R24.2
N$39
  Top 0.381: R25.2 19.05,37.47 18.8,37.22 U9.1
N$40
  Top 0.381: R25.1 22.86,37.47 23.11,37.22 U9.8
N$41
  Top 0.381: C26.1 23.86,34.6 U9.6
N$42
  Top 0.381: R26.1 C26.2 26.54,33.69 R27.2
N$43
  Top 0.254: Y2.1 44.06,51.37 42.88,50.19 U14.25 40.17,52.01 C69.2
N$44
  Top 0.254: C46.1 36.83,53.02 38.67,51.19 U14.28
N$45
  Top 0.254: U14.14 39.17,42.26 C44.2
N$46
  Top 0.254: Y2.3 40.47,57.37 C68.2 38.29,55.97 38.29,52.45 39.67,51.07 U14.26
N$47
  Top 0.254: U14.12 38.17,41.75 C45.2
N$48
  Top 0.254: Y3.3 40.79,36.41 C70.2 39.97,36.41 38.61,35.05 38.61,31.5 39.98,30.12 U15.26
N$49
  Top 0.254: U15.28 38.98,30.1 37.17,31.92 C51.1
N$50
  Top 0.254: C49.2 39.48,21.05 U15.14
N$51
  Top 0.254: Y3.1 44.38,30.41 43.2,29.23 U15.25 40.48,31.05 C71.2
N$52
  Top 0.254: C50.2 38.48,21.05 U15.12
N$53
  Top 0.381: R28.2 19.05,32.38 18.8,32.14 U10.1
N$54
  Top 0.381: R28.1 22.86,32.38 23.11,32.14 U10.8
N$55
  Top 0.381: C29.1 23.86,29.52 U10.6
N$56
  Top 0.381: R29.1 C29.2 26.54,28.61 R30.2
N$57
  Top 0.381: R31.2 19.05,27.3 18.8,27.06 U11.1
N$58
  Top 0.381: R31.1 22.86,27.3 23.11,27.06 U11.8
N$59
  Top 0.381: C32.1 23.86,24.44 U11.6
N$60
  Top 0.381: R32.1 C32.2 26.54,23.53 R33.2
N$61
  Top 0.381: R34.2 19.05,22.23 18.8,21.98 U12.1
N$62
  Top 0.381: R34.1 22.86,22.23 23.11,21.98 U12.8
N$63
  Top 0.381: C35.1 23.86,19.36 U12.6
N$64
  Top 0.381: R35.1 C35.2 26.54,18.45 R36.2
N$65
  Top 0.254: U17.60 69.48,67.79 R45.2
N$66
  Top 0.254: U17.7 61.71,73.97 R46.2
N$67
  Top 0.254: R44.2 C53.2 | C53.2 R43.1 | C53.2 12.6,75.25 U16.3
N$68
  Top 0.381: LED1.A R47.1
N$69
  Top 0.381: LED2.A 49.91,24.3 R48.1
N$70
  Top 0.381: LED3.A 50.8,36.67 51.59,37.47 R49.1
N$71
  Top 0.381: R50.1 LED4.A
N$72
  Top 0.381: R51.1 LED5.A
N$73
  Top 0.381: R52.1 53.28,58.01 LED6.A
N$74
  Top 0.254: R54.2 66.48,43.84 J1.A5
N$75
  Top 0.254: R53.1 66.41,46.84 J1.B5
N$76
  Top 0.254: IC1.2 51.7,29.84 51.05,30.48 JP5.2
N$78
  Top 0.254: JP6.2 60.96,39.37 62.79,37.54 IC2.4 IC2.2
SWCLK
  Top 0.254: U17.49 66.67,62.27 67.27,62.27 71.75,57.78 71.75,56.2 JP4.2
SWDIO
  Top 0.254: JP4.3 64.45,56.83 63.7,57.58 U17.46
UART_RX
  Top 0.254: JP3.3 71.06,65.41 69.44,63.79 U17.52
UART_TX
  Top 0.254: JP3.2 69.85,62.87 69.42,63.29 U17.51
USB+
  Top 0.254: U17.45 63.21,47.28 64.66,45.84 J1.B6 68.47,45.84 68.58,45.72 68.58,45.09 68.33,44.84 J1.A6
USB-
  Top 0.254: U17.44 62.71,45.88 64.25,44.34 66.67,44.34 | 66.67,44.34 J1.B7 | J1.A7 66.92,45.34 66.67,45.09 66.67,44.34
VBUS
  Top 0.254: J1.A4_B9 68.42,42.69 69.22,43.48 69.22,46.61 68.34,47.48 J1.B4_A9

### Text on the board
tPlace: 2V5 | Twin Io V00-00-00 | By Pascal Bilger 03.03.2024 | ADC0 | ADC1 | ADC2 | RX | REF(RL) | TX | LD0(LL) | ADC3 | GND | LD1(RA) | LD2(LA) | SWDIO | ADC4 | LD3(V1) | SWCLK | LD4(V2) | GND | ADC5 | LD5(V3) | LD6(V4) | ADC6 | LD7(V5) | LD8(V6) | 3V3 | ADC7 | LD9 | LD10 | ADC8 | 3V3 | LD11 | SPARE | GND | ADC9 | 5V | 9V_IN | ADC10 | ADC11 | 9V | 5V